# EasyEDA Pro project EasyMatrix工程文件.epro

# Schematic Schematic2_1
Create Date: 2024-02-18; Page Name: P1; Project Name: EasyMatrix像素钟; Schematic Name: Schematic2_1; Update Date: 2024-02-18; Company: 嘉立创EDA; Page Size: A4; Version: V1.0
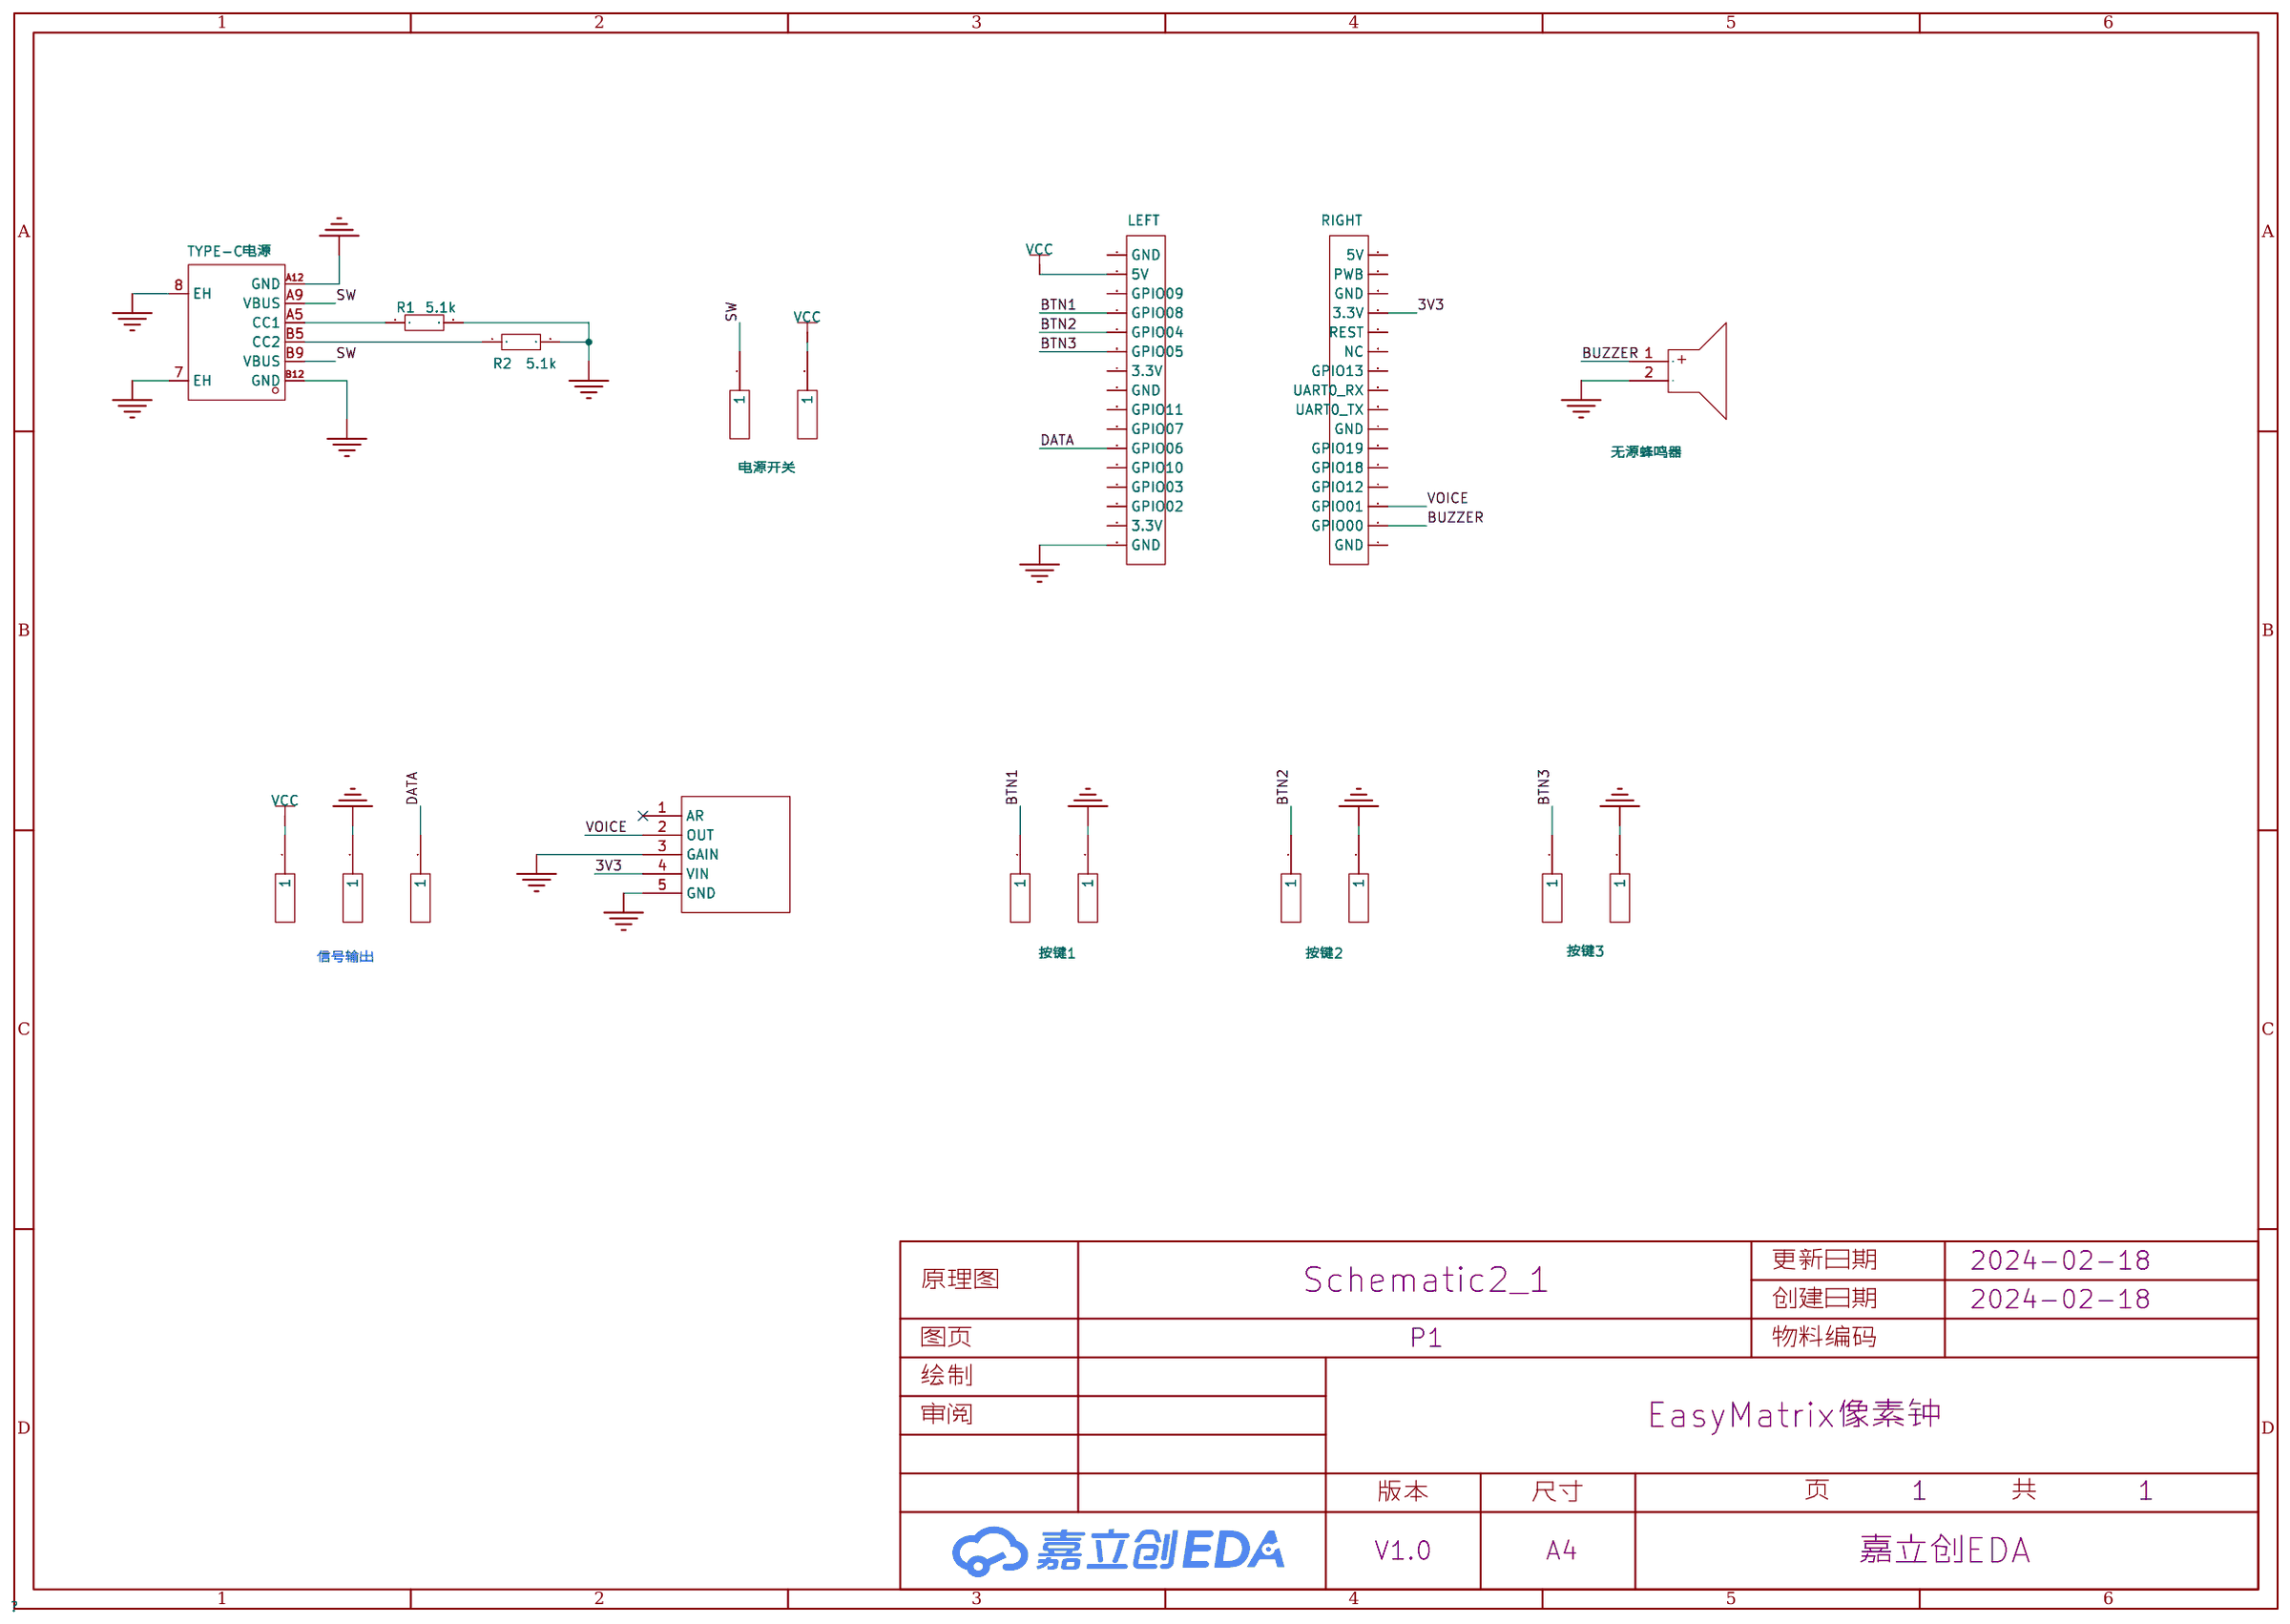
[diagram p0: schematic sheet]

## Parts
LEFT  HDR-F-2.54_1x16  [HDR-F-2.54_1X16]
R1  5.1k  [R0805]
R2  5.1k  [R0805]
RIGHT  HDR-F-2.54_1x16  [HDR-F-2.54_1X16]
TYPE-C电源  TYPE-C 6P LT6.8(073)  [USB-C-SMD_TYPE-C-6P-LT6.8-073]
U1  -  [长圆形单面焊盘]
U4  -  [长圆形单面焊盘]
U6  -  [长圆形单面焊盘]
U8  -  [长圆形单面焊盘]
U10  -  [长圆形单面焊盘]
U13  -  [长圆形单面焊盘]
U14  -  [长圆形单面焊盘]
U15  -  [MAX9814模块]
按键1  -  [长圆形单面焊盘]
按键2  -  [长圆形单面焊盘]
按键3  -  [长圆形单面焊盘]
无源蜂鸣器  无源蜂鸣器  [BUZ-TH_BD12.0-P6.50-D0.6-FD]
电源开关  -  [长圆形单面焊盘]

## Library data of the parts
LEFT RIGHT = HDR-F-2.54_1x16: Supplier Part: C66987; Supplier: LCSC
R1 R2 = Res_0805: Supplier Footprint: 0805
TYPE-C电源 = TYPE-C 6P LT6.8(073): 连接器类型:Type-C;标准:-;公母:母;端口数量:1;触点数量:6P;安装方式:立贴;额定电流 - 电源:3A;工作温度范围:-25℃~+85℃;; LCSC Part Name: Type-C 母 立贴; Supplier Part: C2858271; Manufacturer: SHOU HAN(首韩); Supplier Footprint: SMD; JLCPCB Part Class: 扩展库; Supplier: LCSC; Connector Type: Type-C; Gender: 母; Number of Ports: 1; Number of Contacts: 6P; Mounting Style: 立贴; Current Rating - Power (Max): 3A; Operating Temperature Range: -25℃~+85℃
U1 U4 U6 U8 U10 U13 U14 按键1-按键3 电源开关 = 长圆形单面焊盘
U15 = MAX9814模块: 麦克风放大器; Datasheet: https://github.com/adafruit/Adafruit-MAX9814-AGC-Microphone-PCB
无源蜂鸣器 = YS-MBZ12095C05R42K4000: LCSC Part Name: 蜂鸣器 无源5V42欧4000HZ; Supplier Part: C2891357; Manufacturer: Fengming(锋鸣电子); Supplier Footprint: 插件,P=6.5mm; Datasheet: https://atta.szlcsc.com/upload/public/pdf/source/20210903/1BFBC8824417868F880E44F43CB98B3A.pdf; Supplier: LCSC

## Nets
3V3: RIGHT.13(3.3V) U15.4(VIN)
GND: LEFT.16(GND) R1.2 R2.2 TYPE-C电源.7(EH) TYPE-C电源.8(EH) TYPE-C电源.A12(GND) TYPE-C电源.B12(GND) U1.1 U15.3(GAIN) U15.5(GND) 按键1.1 按键2.1 按键3.1 无源蜂鸣器.2(-)
VCC: LEFT.2(5V) U13.1 电源开关.1
BTN1: LEFT.4(GPIO08) U6.1
BTN2: LEFT.5(GPIO04) U8.1
BTN3: LEFT.6(GPIO05) U10.1
BUZZER: RIGHT.2(GPIO00) 无源蜂鸣器.1(+)
DATA: LEFT.11(GPIO06) U14.1
SW: TYPE-C电源.A9(VBUS) TYPE-C电源.B9(VBUS) U4.1
VOICE: RIGHT.3(GPIO01) U15.2(OUT)
$1N4002: R1.1 TYPE-C电源.A5(CC1)
$1N4005: R2.1 TYPE-C电源.B5(CC2)

Not connected (* = marked no-connect by the designer): LEFT 1(GND) 3(GPIO09) 7(3.3V) 8(GND) 9(GPIO11) 10(GPIO07) 12(GPIO10) 13(GPIO03) 14(GPIO02) 15(3.3V); RIGHT 1(GND) 4(GPIO12) 5(GPIO18) 6(GPIO19) 7(GND) 8(UART0_TX) 9(UART0_RX) 10(GPIO13) 11(NC) 12(REST) 14(GND) 15(PWB) 16(5V); U15 1(AR)*

## Notes on the sheet
- 信号输出

# Schematic Schematic
Create Date: 2024-01-07; Page Name: P1; Project Name: EasyMatrix像素钟; Schematic Name: Schematic; Update Date: 2024-01-12; Company: 嘉立创EDA; Page Size: A4; Version: V1.0
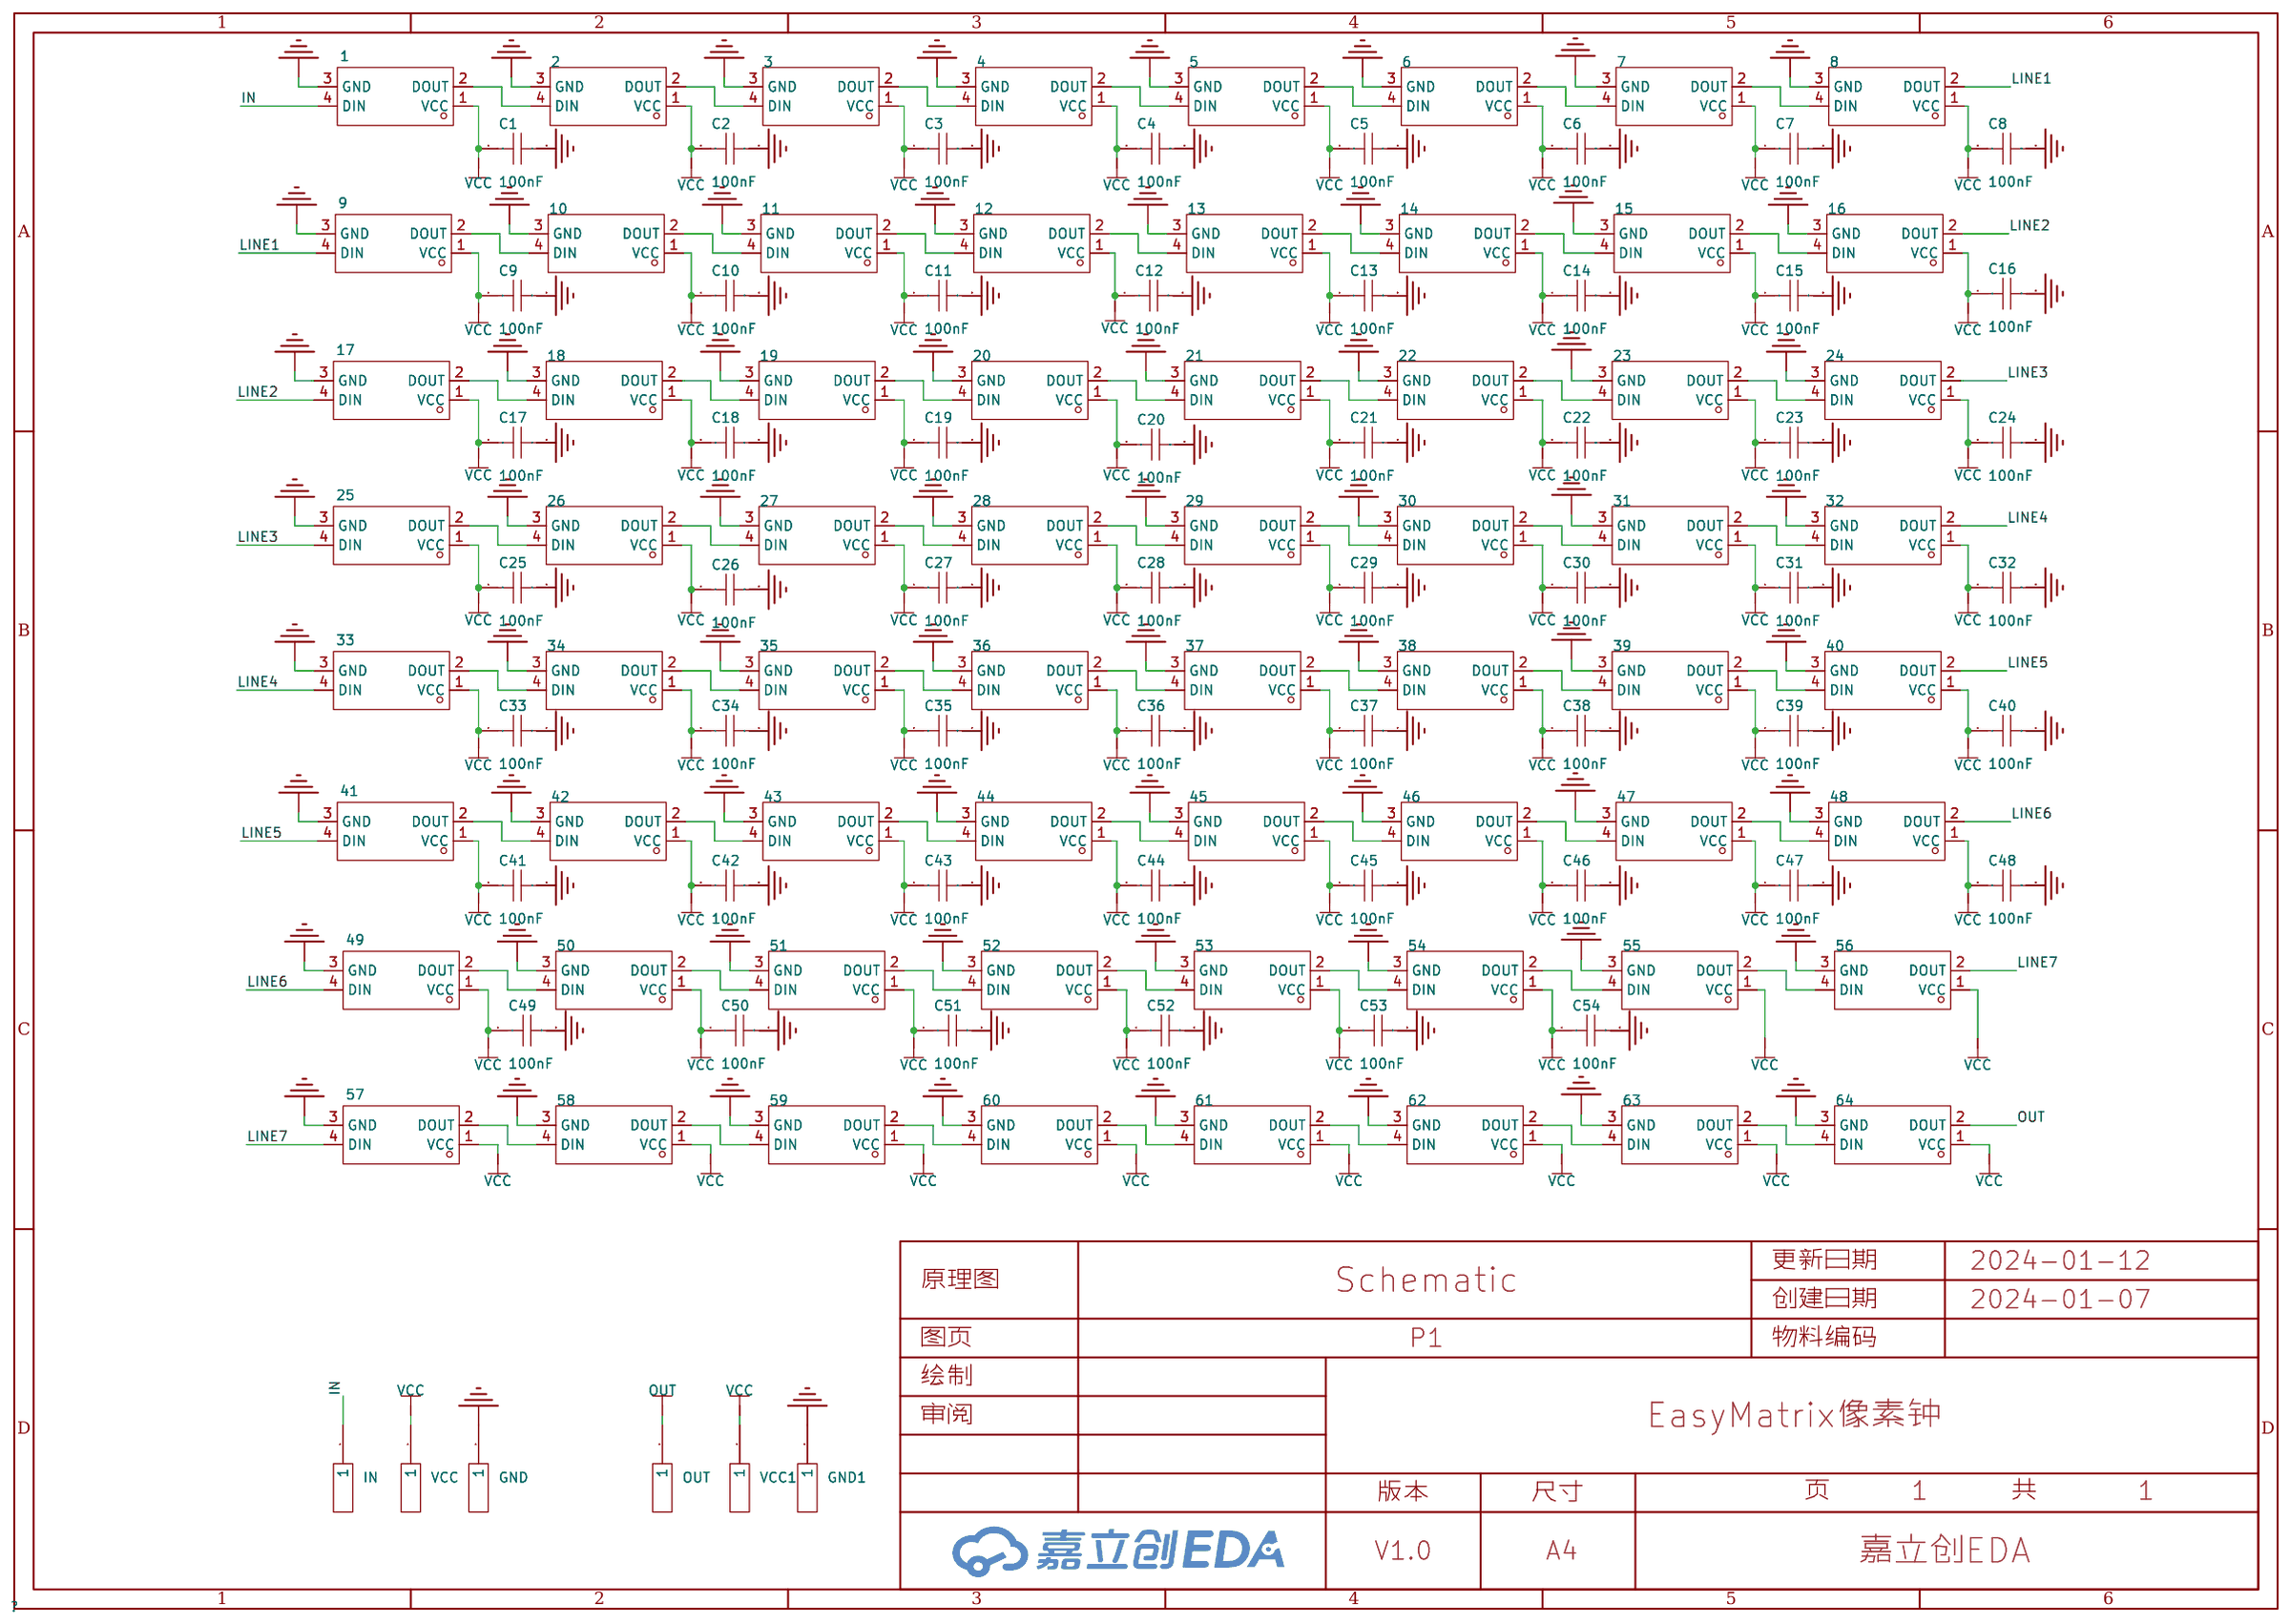
[diagram p1: schematic sheet]

## Parts
1  XL-3528RGBW-WS2812B  [LED-SMD_4P-L3.5-W2.8-BR-1]
2  XL-3528RGBW-WS2812B  [LED-SMD_4P-L3.5-W2.8-BR-1]
3  XL-3528RGBW-WS2812B  [LED-SMD_4P-L3.5-W2.8-BR-1]
4  XL-3528RGBW-WS2812B  [LED-SMD_4P-L3.5-W2.8-BR-1]
5  XL-3528RGBW-WS2812B  [LED-SMD_4P-L3.5-W2.8-BR-1]
6  XL-3528RGBW-WS2812B  [LED-SMD_4P-L3.5-W2.8-BR-1]
7  XL-3528RGBW-WS2812B  [LED-SMD_4P-L3.5-W2.8-BR-1]
8  XL-3528RGBW-WS2812B  [LED-SMD_4P-L3.5-W2.8-BR-1]
9  XL-3528RGBW-WS2812B  [LED-SMD_4P-L3.5-W2.8-BR-1]
10  XL-3528RGBW-WS2812B  [LED-SMD_4P-L3.5-W2.8-BR-1]
11  XL-3528RGBW-WS2812B  [LED-SMD_4P-L3.5-W2.8-BR-1]
12  XL-3528RGBW-WS2812B  [LED-SMD_4P-L3.5-W2.8-BR-1]
13  XL-3528RGBW-WS2812B  [LED-SMD_4P-L3.5-W2.8-BR-1]
14  XL-3528RGBW-WS2812B  [LED-SMD_4P-L3.5-W2.8-BR-1]
15  XL-3528RGBW-WS2812B  [LED-SMD_4P-L3.5-W2.8-BR-1]
16  XL-3528RGBW-WS2812B  [LED-SMD_4P-L3.5-W2.8-BR-1]
17  XL-3528RGBW-WS2812B  [LED-SMD_4P-L3.5-W2.8-BR-1]
18  XL-3528RGBW-WS2812B  [LED-SMD_4P-L3.5-W2.8-BR-1]
19  XL-3528RGBW-WS2812B  [LED-SMD_4P-L3.5-W2.8-BR-1]
20  XL-3528RGBW-WS2812B  [LED-SMD_4P-L3.5-W2.8-BR-1]
21  XL-3528RGBW-WS2812B  [LED-SMD_4P-L3.5-W2.8-BR-1]
22  XL-3528RGBW-WS2812B  [LED-SMD_4P-L3.5-W2.8-BR-1]
23  XL-3528RGBW-WS2812B  [LED-SMD_4P-L3.5-W2.8-BR-1]
24  XL-3528RGBW-WS2812B  [LED-SMD_4P-L3.5-W2.8-BR-1]
25  XL-3528RGBW-WS2812B  [LED-SMD_4P-L3.5-W2.8-BR-1]
26  XL-3528RGBW-WS2812B  [LED-SMD_4P-L3.5-W2.8-BR-1]
27  XL-3528RGBW-WS2812B  [LED-SMD_4P-L3.5-W2.8-BR-1]
28  XL-3528RGBW-WS2812B  [LED-SMD_4P-L3.5-W2.8-BR-1]
29  XL-3528RGBW-WS2812B  [LED-SMD_4P-L3.5-W2.8-BR-1]
30  XL-3528RGBW-WS2812B  [LED-SMD_4P-L3.5-W2.8-BR-1]
31  XL-3528RGBW-WS2812B  [LED-SMD_4P-L3.5-W2.8-BR-1]
32  XL-3528RGBW-WS2812B  [LED-SMD_4P-L3.5-W2.8-BR-1]
33  XL-3528RGBW-WS2812B  [LED-SMD_4P-L3.5-W2.8-BR-1]
34  XL-3528RGBW-WS2812B  [LED-SMD_4P-L3.5-W2.8-BR-1]
35  XL-3528RGBW-WS2812B  [LED-SMD_4P-L3.5-W2.8-BR-1]
36  XL-3528RGBW-WS2812B  [LED-SMD_4P-L3.5-W2.8-BR-1]
37  XL-3528RGBW-WS2812B  [LED-SMD_4P-L3.5-W2.8-BR-1]
38  XL-3528RGBW-WS2812B  [LED-SMD_4P-L3.5-W2.8-BR-1]
39  XL-3528RGBW-WS2812B  [LED-SMD_4P-L3.5-W2.8-BR-1]
40  XL-3528RGBW-WS2812B  [LED-SMD_4P-L3.5-W2.8-BR-1]
41  XL-3528RGBW-WS2812B  [LED-SMD_4P-L3.5-W2.8-BR-1]
42  XL-3528RGBW-WS2812B  [LED-SMD_4P-L3.5-W2.8-BR-1]
43  XL-3528RGBW-WS2812B  [LED-SMD_4P-L3.5-W2.8-BR-1]
44  XL-3528RGBW-WS2812B  [LED-SMD_4P-L3.5-W2.8-BR-1]
45  XL-3528RGBW-WS2812B  [LED-SMD_4P-L3.5-W2.8-BR-1]
46  XL-3528RGBW-WS2812B  [LED-SMD_4P-L3.5-W2.8-BR-1]
47  XL-3528RGBW-WS2812B  [LED-SMD_4P-L3.5-W2.8-BR-1]
48  XL-3528RGBW-WS2812B  [LED-SMD_4P-L3.5-W2.8-BR-1]
49  XL-3528RGBW-WS2812B  [LED-SMD_4P-L3.5-W2.8-BR-1]
50  XL-3528RGBW-WS2812B  [LED-SMD_4P-L3.5-W2.8-BR-1]
51  XL-3528RGBW-WS2812B  [LED-SMD_4P-L3.5-W2.8-BR-1]
52  XL-3528RGBW-WS2812B  [LED-SMD_4P-L3.5-W2.8-BR-1]
53  XL-3528RGBW-WS2812B  [LED-SMD_4P-L3.5-W2.8-BR-1]
54  XL-3528RGBW-WS2812B  [LED-SMD_4P-L3.5-W2.8-BR-1]
55  XL-3528RGBW-WS2812B  [LED-SMD_4P-L3.5-W2.8-BR-1]
56  XL-3528RGBW-WS2812B  [LED-SMD_4P-L3.5-W2.8-BR-1]
57  XL-3528RGBW-WS2812B  [LED-SMD_4P-L3.5-W2.8-BR-1]
58  XL-3528RGBW-WS2812B  [LED-SMD_4P-L3.5-W2.8-BR-1]
59  XL-3528RGBW-WS2812B  [LED-SMD_4P-L3.5-W2.8-BR-1]
60  XL-3528RGBW-WS2812B  [LED-SMD_4P-L3.5-W2.8-BR-1]
61  XL-3528RGBW-WS2812B  [LED-SMD_4P-L3.5-W2.8-BR-1]
62  XL-3528RGBW-WS2812B  [LED-SMD_4P-L3.5-W2.8-BR-1]
63  XL-3528RGBW-WS2812B  [LED-SMD_4P-L3.5-W2.8-BR-1]
64  XL-3528RGBW-WS2812B  [LED-SMD_4P-L3.5-W2.8-BR-1]
C1  100nF  [C0805]
C2  100nF  [C0805]
C3  100nF  [C0805]
C4  100nF  [C0805]
C5  100nF  [C0805]
C6  100nF  [C0805]
C7  100nF  [C0805]
C8  100nF  [C0805]
C9  100nF  [C0805]
C10  100nF  [C0805]
C11  100nF  [C0805]
C12  100nF  [C0805]
C13  100nF  [C0805]
C14  100nF  [C0805]
C15  100nF  [C0805]
C16  100nF  [C0805]
C17  100nF  [C0805]
C18  100nF  [C0805]
C19  100nF  [C0805]
C20  100nF  [C0805]
C21  100nF  [C0805]
C22  100nF  [C0805]
C23  100nF  [C0805]
C24  100nF  [C0805]
C25  100nF  [C0805]
C26  100nF  [C0805]
C27  100nF  [C0805]
C28  100nF  [C0805]
C29  100nF  [C0805]
C30  100nF  [C0805]
C31  100nF  [C0805]
C32  100nF  [C0805]
C33  100nF  [C0805]
C34  100nF  [C0805]
C35  100nF  [C0805]
C36  100nF  [C0805]
C37  100nF  [C0805]
C38  100nF  [C0805]
C39  100nF  [C0805]
C40  100nF  [C0805]
C41  100nF  [C0805]
C42  100nF  [C0805]
C43  100nF  [C0805]
C44  100nF  [C0805]
C45  100nF  [C0805]
C46  100nF  [C0805]
C47  100nF  [C0805]
C48  100nF  [C0805]
C49  100nF  [C0805]
C50  100nF  [C0805]
C51  100nF  [C0805]
C52  100nF  [C0805]
C53  100nF  [C0805]
C54  100nF  [C0805]
GND  -  [长圆形单面焊盘]
GND1  -  [长圆形单面焊盘]
IN  -  [长圆形单面焊盘]
OUT  -  [长圆形单面焊盘]
VCC  -  [长圆形单面焊盘]
VCC1  -  [长圆形单面焊盘]

## Library data of the parts
1-64 = XL-3528RGBW-WS2812B: 发光颜色:RGB三色;二极管配置:共阳极;主波长:618nm~623nm；520nm~525nm；467nm~472nm;峰值波长:525nm；623nm；472nm;光通量(25℃时):-;测试电流:20mA;正向电压(VF):3.4V；3.4V；2.4V;发光强度:143mcd；240mcd；845mcd;功率:50mW；50mW；45mW;发光角度:120°;安装方式:正贴;工作温度:-25℃~+80℃;; LCSC Part Name: RGB三色 共阳极 正贴 幻彩; Supplier Part: C2890364; Manufacturer: XINGLIGHT(成兴光); Supplier Footprint: SMD,3.5x2.8x1.85mm; JLCPCB Part Class: 扩展库; Datasheet: https://atta.szlcsc.com/upload/public/pdf/source/20210827/1CA9F253977F45DC01BA0C3D415B306E.pdf; Supplier: LCSC; Emitted Color: RGB三色; Diode Configuration: 共阳极; Dominant Wavelength: 618nm~623nm；520nm~525nm；467nm~472nm; Peak Wavelength: 525nm；623nm；472nm; Forward Current: 20mA; Forward Voltage (VF): 3.4V；3.4V；2.4V; Luminous Intensity: 143mcd；240mcd；845mcd; Power Dissipation: 50mW；50mW；45mW; Viewing Angle: 120°; Mounting Sytle: 正贴; Operating Temperature: -25℃~+80℃
C1-C54 = CAP_0805: Supplier Footprint: 0805
GND GND1 IN OUT VCC VCC1 = 长圆形单面焊盘

## Nets
GND: 1.3(GND) 2.3(GND) 3.3(GND) 4.3(GND) 5.3(GND) 6.3(GND) 7.3(GND) 8.3(GND) 9.3(GND) 10.3(GND) 11.3(GND) 12.3(GND) 13.3(GND) 14.3(GND) 15.3(GND) 16.3(GND) 17.3(GND) 18.3(GND) 19.3(GND) 20.3(GND) 21.3(GND) 22.3(GND) 23.3(GND) 24.3(GND) 25.3(GND) 26.3(GND) 27.3(GND) 28.3(GND) 29.3(GND) 30.3(GND) 31.3(GND) 32.3(GND) 33.3(GND) 34.3(GND) 35.3(GND) 36.3(GND) 37.3(GND) 38.3(GND) 39.3(GND) 40.3(GND) 41.3(GND) 42.3(GND) 43.3(GND) 44.3(GND) 45.3(GND) 46.3(GND) 47.3(GND) 48.3(GND) 49.3(GND) 50.3(GND) 51.3(GND) 52.3(GND) 53.3(GND) 54.3(GND) 55.3(GND) 56.3(GND) 57.3(GND) 58.3(GND) 59.3(GND) 60.3(GND) 61.3(GND) 62.3(GND) 63.3(GND) 64.3(GND) C1.2 C2.2 C3.2 C4.2 C5.2 C6.2 C7.2 C8.2 C9.2 C10.2 C11.2 C12.2 C13.2 C14.2 C15.2 C16.2 C17.2 C18.2 C19.2 C20.2 C21.2 C22.2 C23.2 C24.2 C25.2 C26.2 C27.2 C28.2 C29.2 C30.2 C31.2 C32.2 C33.2 C34.2 C35.2 C36.2 C37.2 C38.2 C39.2 C40.2 C41.2 C42.2 C43.2 C44.2 C45.2 C46.2 C47.2 C48.2 C49.2 C50.2 C51.2 C52.2 C53.2 C54.2 GND.1 GND1.1
VCC: 1.1(VCC) 2.1(VCC) 3.1(VCC) 4.1(VCC) 5.1(VCC) 6.1(VCC) 7.1(VCC) 8.1(VCC) 9.1(VCC) 10.1(VCC) 11.1(VCC) 12.1(VCC) 13.1(VCC) 14.1(VCC) 15.1(VCC) 16.1(VCC) 17.1(VCC) 18.1(VCC) 19.1(VCC) 20.1(VCC) 21.1(VCC) 22.1(VCC) 23.1(VCC) 24.1(VCC) 25.1(VCC) 26.1(VCC) 27.1(VCC) 28.1(VCC) 29.1(VCC) 30.1(VCC) 31.1(VCC) 32.1(VCC) 33.1(VCC) 34.1(VCC) 35.1(VCC) 36.1(VCC) 37.1(VCC) 38.1(VCC) 39.1(VCC) 40.1(VCC) 41.1(VCC) 42.1(VCC) 43.1(VCC) 44.1(VCC) 45.1(VCC) 46.1(VCC) 47.1(VCC) 48.1(VCC) 49.1(VCC) 50.1(VCC) 51.1(VCC) 52.1(VCC) 53.1(VCC) 54.1(VCC) 55.1(VCC) 56.1(VCC) 57.1(VCC) 58.1(VCC) 59.1(VCC) 60.1(VCC) 61.1(VCC) 62.1(VCC) 63.1(VCC) 64.1(VCC) C1.1 C2.1 C3.1 C4.1 C5.1 C6.1 C7.1 C8.1 C9.1 C10.1 C11.1 C12.1 C13.1 C14.1 C15.1 C16.1 C17.1 C18.1 C19.1 C20.1 C21.1 C22.1 C23.1 C24.1 C25.1 C26.1 C27.1 C28.1 C29.1 C30.1 C31.1 C32.1 C33.1 C34.1 C35.1 C36.1 C37.1 C38.1 C39.1 C40.1 C41.1 C42.1 C43.1 C44.1 C45.1 C46.1 C47.1 C48.1 C49.1 C50.1 C51.1 C52.1 C53.1 C54.1 VCC.1 VCC1.1
IN: 1.4(DIN) IN.1
LINE1: 8.2(DOUT) 9.4(DIN)
LINE2: 16.2(DOUT) 17.4(DIN)
LINE3: 24.2(DOUT) 25.4(DIN)
LINE4: 32.2(DOUT) 33.4(DIN)
LINE5: 40.2(DOUT) 41.4(DIN)
LINE6: 48.2(DOUT) 49.4(DIN)
LINE7: 56.2(DOUT) 57.4(DIN)
OUT: 64.2(DOUT) OUT.1
$1N1182: 1.2(DOUT) 2.4(DIN)
$1N1185: 2.2(DOUT) 3.4(DIN)
$1N1190: 4.2(DOUT) 5.4(DIN)
$1N1193: 5.2(DOUT) 6.4(DIN)
$1N1194: 3.2(DOUT) 4.4(DIN)
$1N1199: 7.2(DOUT) 8.4(DIN)
$1N1203: 6.2(DOUT) 7.4(DIN)
$1N7369: 9.2(DOUT) 10.4(DIN)
$1N7372: 10.2(DOUT) 11.4(DIN)
$1N7377: 12.2(DOUT) 13.4(DIN)
$1N7380: 13.2(DOUT) 14.4(DIN)
$1N7381: 11.2(DOUT) 12.4(DIN)
$1N7386: 15.2(DOUT) 16.4(DIN)
$1N7387: 14.2(DOUT) 15.4(DIN)
$1N7912: 17.2(DOUT) 18.4(DIN)
$1N7915: 18.2(DOUT) 19.4(DIN)
$1N7920: 20.2(DOUT) 21.4(DIN)
$1N7923: 21.2(DOUT) 22.4(DIN)
$1N7924: 19.2(DOUT) 20.4(DIN)
$1N7929: 23.2(DOUT) 24.4(DIN)
$1N7930: 22.2(DOUT) 23.4(DIN)
$1N8455: 25.2(DOUT) 26.4(DIN)
$1N8458: 26.2(DOUT) 27.4(DIN)
$1N8463: 28.2(DOUT) 29.4(DIN)
$1N8466: 29.2(DOUT) 30.4(DIN)
$1N8467: 27.2(DOUT) 28.4(DIN)
$1N8472: 31.2(DOUT) 32.4(DIN)
$1N8473: 30.2(DOUT) 31.4(DIN)
$1N8998: 33.2(DOUT) 34.4(DIN)
$1N9001: 34.2(DOUT) 35.4(DIN)
$1N9006: 36.2(DOUT) 37.4(DIN)
$1N9009: 37.2(DOUT) 38.4(DIN)
$1N9010: 35.2(DOUT) 36.4(DIN)
$1N9015: 39.2(DOUT) 40.4(DIN)
$1N9016: 38.2(DOUT) 39.4(DIN)
$1N9541: 41.2(DOUT) 42.4(DIN)
$1N9544: 42.2(DOUT) 43.4(DIN)
$1N9549: 44.2(DOUT) 45.4(DIN)
$1N9552: 45.2(DOUT) 46.4(DIN)
$1N9553: 43.2(DOUT) 44.4(DIN)
$1N9558: 47.2(DOUT) 48.4(DIN)
$1N9559: 46.2(DOUT) 47.4(DIN)
$1N10084: 49.2(DOUT) 50.4(DIN)
$1N10087: 50.2(DOUT) 51.4(DIN)
$1N10092: 52.2(DOUT) 53.4(DIN)
$1N10095: 53.2(DOUT) 54.4(DIN)
$1N10096: 51.2(DOUT) 52.4(DIN)
$1N10101: 55.2(DOUT) 56.4(DIN)
$1N10102: 54.2(DOUT) 55.4(DIN)
$1N10627: 57.2(DOUT) 58.4(DIN)
$1N10630: 58.2(DOUT) 59.4(DIN)
$1N10635: 60.2(DOUT) 61.4(DIN)
$1N10638: 61.2(DOUT) 62.4(DIN)
$1N10639: 59.2(DOUT) 60.4(DIN)
$1N10644: 63.2(DOUT) 64.4(DIN)
$1N10645: 62.2(DOUT) 63.4(DIN)

# Board PCB3_1
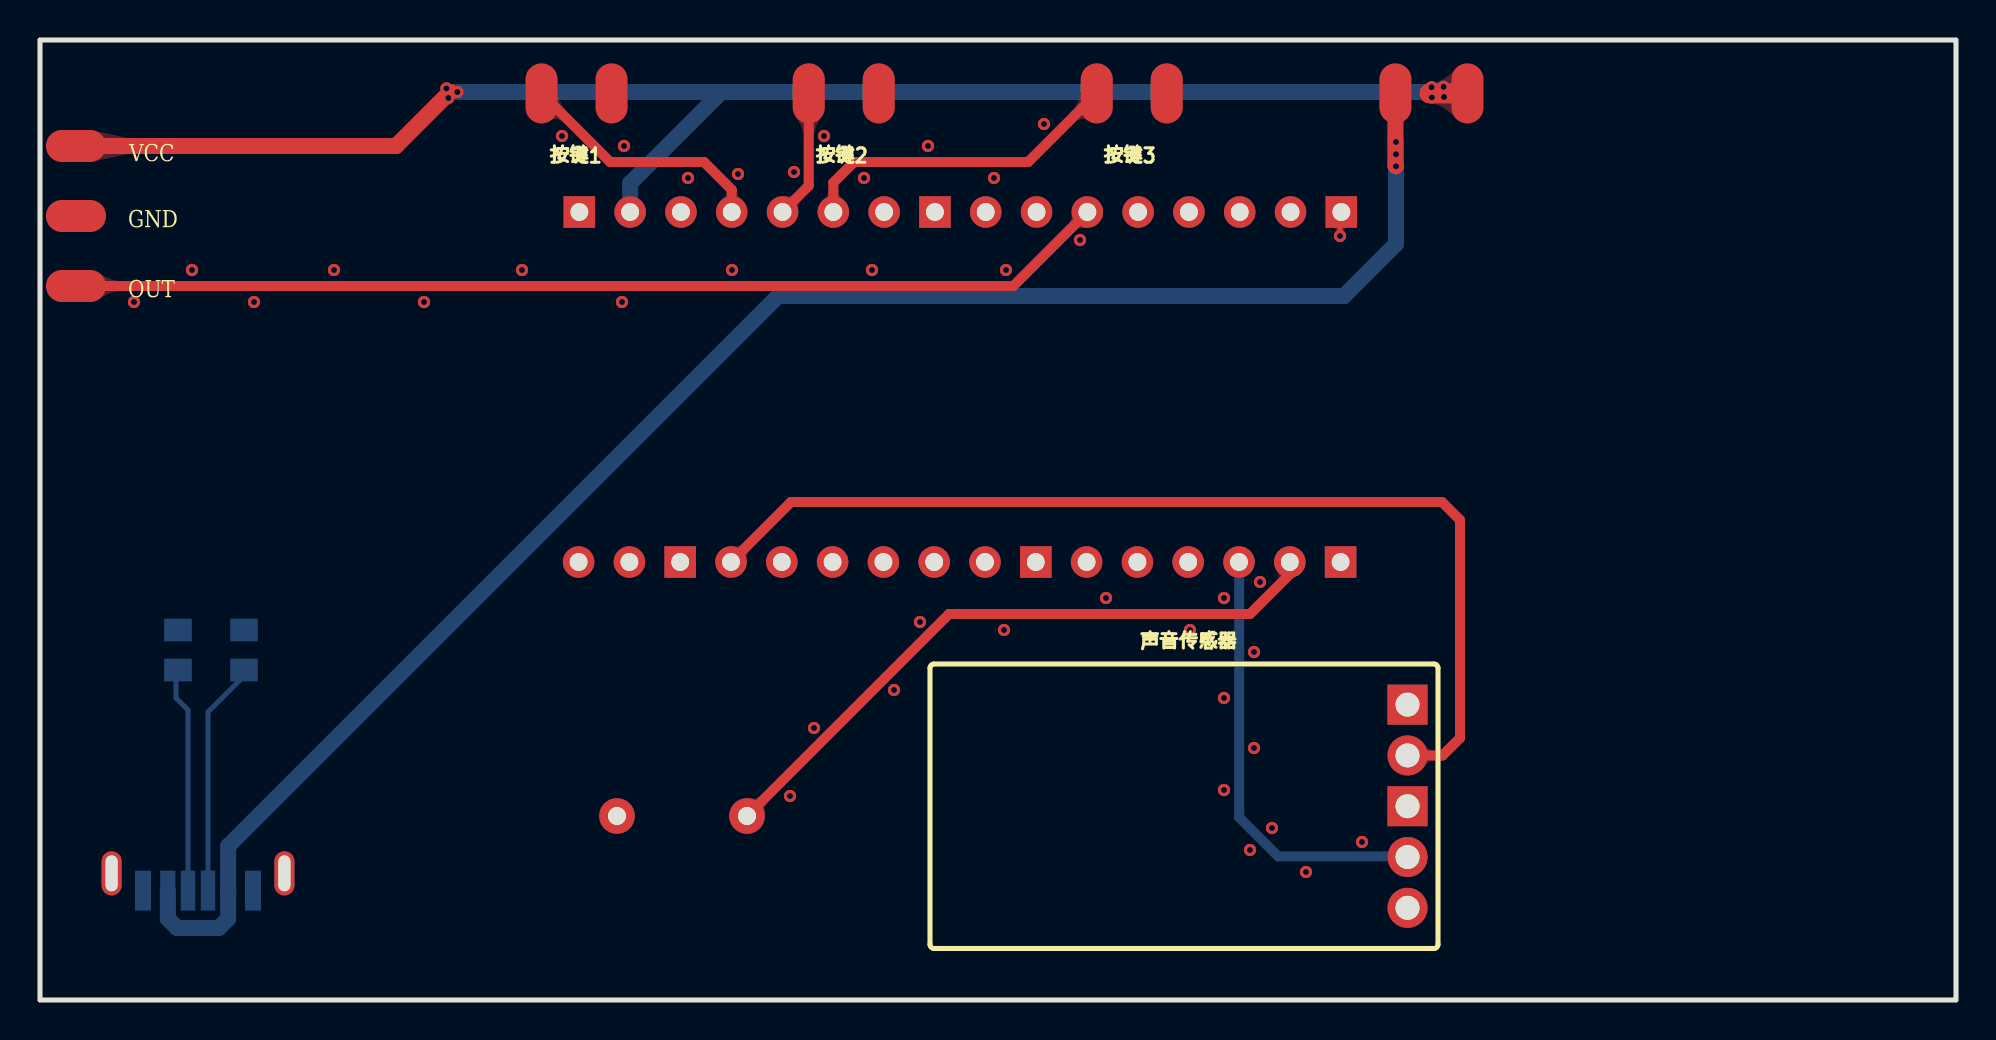
[diagram p2: board, top side]
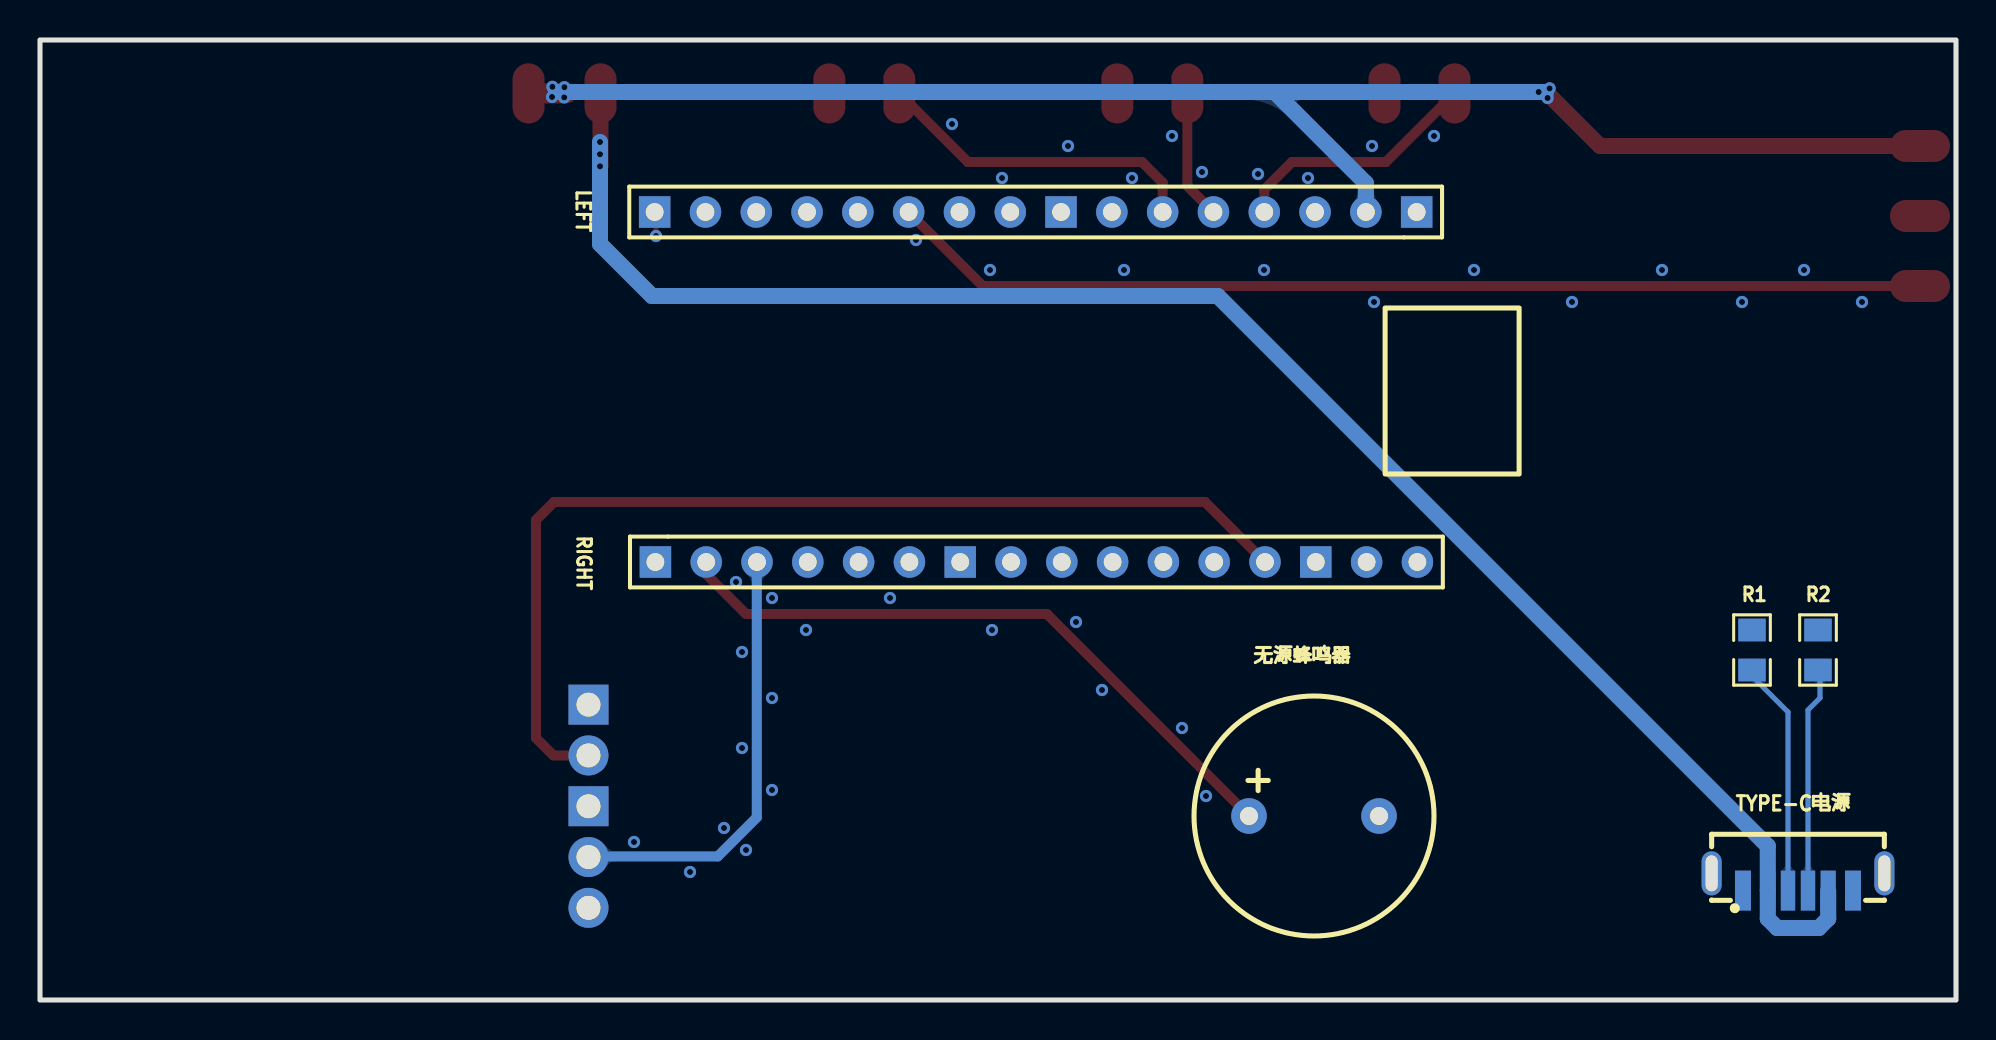
[diagram p3: board, bottom side, seen from below]

Outline 95.8 x 48 mm; copper layers: Top Layer, Bottom Layer. Coordinates in mm from the lower left corner of the outline.
Outline path: rectangle 0,48 95.8,0
Stack: Top Layer 0.035mm - / Dielectric1 1.51mm FR4 er 4.5 / Bottom Layer 0.035mm -

## Design rules (mm)
template: JLCPCB Capability(Two Layers Board)
spacing copperThickness1oz (default): track to track 0.102, other pairs 0.152 to 0.3
spacing copperThickness2oz: track to track 0.203, other pairs 0.152 to 0.3
track width copperThickness1oz (default): min 0.127, default 0.254, max 2.54
track width copperThickness2oz: min 0.203, default 0.254, max 2.54
differential pair differentialPair (default): width min 0.127, default 0.254, max 2.54; gap min 0.152, default 0.152
via viaSize (default): diameter min 0.5, default 0.61, max 10; hole min 0.3, default 0.305, max 6.3

## Placement (name value [footprint] x y rotation side)
LEFT  HDR-F-2.54_1x16  [hdr-f-2.54_1x16]  46.02 39.4 0 bottom
NOREF  -  [长圆形单面焊盘]  1.8 39.33 0 top
R1  5.1k  [R0805]  10.2 17.5 90 bottom
R2  5.1k  [R0805]  6.9 17.5 90 bottom
RIGHT  HDR-F-2.54_1x16  [HDR-F-2.54_1X16]  45.98 21.9 180 bottom
TYPE-C电源  TYPE-C 6P LT6.8(073)  [USB-C-SMD_TYPE-C-6P-LT6.8-073]  7.9 5.9 180 bottom
U4  -  [长圆形单面焊盘]  67.9 45.33 270 top
U6  -  [长圆形单面焊盘]  24.95 45.33 90 top
U8  -  [长圆形单面焊盘]  38.31 45.33 90 top
U10  -  [长圆形单面焊盘]  52.71 45.33 90 top
U13  -  [长圆形单面焊盘]  1.8 42.83 0 top
U14  -  [长圆形单面焊盘]  1.8 35.83 0 top
声音传感器  -  [max9814模块]  44.5 16.8 0 top
按键1  -  [长圆形单面焊盘]  28.45 45.33 90 top
按键2  -  [长圆形单面焊盘]  41.81 45.33 90 top
按键3  -  [长圆形单面焊盘]  56.21 45.33 90 top
无源蜂鸣器  无源蜂鸣器  [BUZ-TH_BD12.0-P6.50-D0.6-FD]  32.1 9.2 180 bottom
电源开关  -  [长圆形单面焊盘]  71.5 45.33 270 top

## Footprints (pads in the part's own frame, mm; a bottom-side part is the same pattern mirrored in y, then rotated)
BUZ-TH_BD12.0-P6.50-D0.6-FD
  round 1.778 hole 0.899: 1(-3.251,0) 2(3.251,0)
HDR-F-2.54_1X16
  rect 1.575x1.575 hole 0.889: 1(-19.05,0) 7(-3.81,0) 14(13.97,0)
  round 1.575 hole 0.889: 2(-16.51,0) 3(-13.97,0) 4(-11.43,0) 5(-8.89,0) 6(-6.35,0) 8(-1.27,0) 9(1.27,0) 10(3.81,0) 11(6.35,0) 12(8.89,0) 13(11.43,0) 15(16.51,0) 16(19.05,0)
hdr-f-2.54_1x16
  rect 1.575x1.575 hole 0.889: 1(-19.05,0) 8(-1.27,0) 16(19.05,0)
  round 1.575 hole 0.889: 2(-16.51,0) 3(-13.97,0) 4(-11.43,0) 5(-8.89,0) 6(-6.35,0) 7(-3.81,0) 9(1.27,0) 10(3.81,0) 11(6.35,0) 12(8.89,0) 13(11.43,0) 14(13.97,0) 15(16.51,0)
max9814模块
  round 2 hole 1.2: 1(23.876,-12.192) 2(23.876,-9.652) 4(23.876,-4.572)
  rect 2x2 hole 1.2: 3(23.876,-7.112) 5(23.876,-2.032)
R0805
  rect 1.133x1.377 smd: 1(-1,0) 2(1,0)
USB-C-SMD_TYPE-C-6P-LT6.8-073
  oval 1x2.2 hole 0.6x1.8: 7(-4.32,0.432) 8(4.32,0.432)
  rect 0.72x2 smd: A5(-0.5,-0.432) B5(0.5,-0.432)
  rect 0.76x2 smd: A9(1.51,-0.432) B9(-1.51,-0.432)
  custom 0.8x2 smd: A12(2.75,-0.432)
  rect 0.8x2 smd: B12(-2.75,-0.432)
长圆形单面焊盘
  oval 3x1.6 smd: 1(0,-0.127)

## Nets
3V3: RIGHT.13 声音传感器.4
GND: LEFT.16 NOREF.1 R1.2 R2.2 TYPE-C电源.7 TYPE-C电源.8 TYPE-C电源.A12 TYPE-C电源.B12 声音传感器.3 声音传感器.5 按键1.1 按键2.1 按键3.1 无源蜂鸣器.2
VCC: LEFT.2 U13.1 电源开关.1
BTN1: LEFT.4 U6.1
BTN2: LEFT.5 U8.1
BTN3: LEFT.6 U10.1
BUZZER: RIGHT.2 无源蜂鸣器.1
DATA: LEFT.11 U14.1
SW: TYPE-C电源.A9 TYPE-C电源.B9 U4.1
VOICE: RIGHT.3 声音传感器.2
$1N4002: R1.1 TYPE-C电源.A5
$1N4005: R2.1 TYPE-C电源.B5

Pads without a net: LEFT 1 3 7 8 9 10 12 13 14 15; RIGHT 1 4 5 6 7 8 9 10 11 12 14 15 16; 声音传感器 1

## Via types
v1: diameter 0.61, hole 0.305, Top Layer to Bottom Layer, 49 vias

## Routing (per net, layer and track width the routed paths; a pad name or vN(x,y) marks a point on that pad's centre or on a via; arc(x,y) is an arc through that point)
3V3: length 52
  Top Layer w0.5: 声音传感器.4 70.13,12.23 71,13.1 71,24 70.1,24.9 37.55,24.9 RIGHT.13
GND: length 1.2
  Top Layer w0.254: 64.99,39.4 65,39.39 v1(65,38.2)
  vias: v1(4.7,34.9) v1(7.6,36.5) v1(10.7,34.9) v1(14.7,36.5) v1(19.2,34.9) v1(24.1,36.5) v1(26.1,43.2) v1(29.1,34.9) v1(29.2,42.7) v1(32.4,41.1) v1(34.6,36.5) v1(34.9,41.3) v1(37.5,10.2) v1(37.7,41.4) v1(38.7,13.6) v1(39.2,43.2) v1(41.2,41.1) v1(41.6,36.5) v1(42.7,15.5) v1(44,18.9) v1(44.4,42.7) v1(47.7,41.1) v1(48.2,18.5) v1(48.3,36.5) v1(50.2,43.8) v1(52,38) v1(53.3,20.1) v1(57.5,18.5) v1(59.2,20.1) v1(59.2,15.1) v1(59.2,10.5) v1(60.5,7.5) v1(60.7,17.4) v1(60.7,12.6) v1(61,20.9) v1(61.6,8.6) v1(63.3,6.4) v1(66.1,7.9)
VCC: length 79.1
  Top Layer w0.254: 29.45,39.38 29.43,39.4
  Top Layer w0.8: 20.5,45.4 17.8,42.7 U13.1
  Top Layer w1: 69.48,45.33 电源开关.1
  Bottom Layer w0.8: 34.07,45.4 70,45.4 ; 34.07,45.4 29.51,40.84 LEFT.2 ; 34.07,45.4 v1(20.87,45.4) 20.5,45.4
  vias: v1(20.32,45.58) v1(20.42,45.1) v1(69.58,45.64) v1(69.59,45.13) v1(70.18,45.66) v1(70.2,45.15)
BTN1: length 12.6
  Top Layer w0.5: U6.1 28.51,41.9 33.2,41.9 34.59,40.51 LEFT.4
BTN2: length 6.5
  Top Layer w0.5: U8.1 38.44,40.71 LEFT.5
BTN3: length 16.5
  Top Layer w0.5: LEFT.6 39.67,40.87 40.7,41.9 49.41,41.9 52.84,45.33
BUZZER: length 32.8
  Top Layer w0.5: 无源蜂鸣器.1 45.45,19.3 60.5,19.3 62.49,21.29 RIGHT.2
DATA: length 52.1
  Top Layer w0.5: LEFT.11 48.67,35.7 U14.1
SW: length 88.1
  Top Layer w0.8: v1(67.8,41.69) 67.77,41.71 U4.1
  Bottom Layer w0.8: TYPE-C电源.A9 6.39,4.07 6.86,3.6 8.94,3.6 9.41,4.07 TYPE-C电源.B9 9.41,7.7 36.91,35.2 65.2,35.2 67.8,37.8 v1(67.8,41.69) v1(67.8,42.29) v1(67.8,42.9)
VOICE: length 22
  Bottom Layer w0.5: 声音传感器.2 68.34,7.18 61.91,7.18 59.96,9.13 59.96,21.89 RIGHT.3
$1N4002: length 11.8
  Bottom Layer w0.254: TYPE-C电源.A5 8.4,14.4 10.2,16.2 R1.1
$1N4005: length 11.3
  Bottom Layer w0.254: TYPE-C电源.B5 7.4,14.5 6.8,15.1 6.8,16.4 R2.1

## Copper pours and planes (outline as drawn; the poured copper is in the pictures)
GND on Top Layer: -2.1,51 99.3,51 99.3,-4.1 -2.1,-4.1
GND on Bottom Layer: -3,52.7 99.7,52.7 99.7,-5.7 -3,-5.7

Small or netless copper shapes (teardrops, artwork), in the pictures only: 17 on Top Layer, 8 on Bottom Layer

## Text on the board
Top Silkscreen Layer: GND | OUT | VCC

# Board PCB
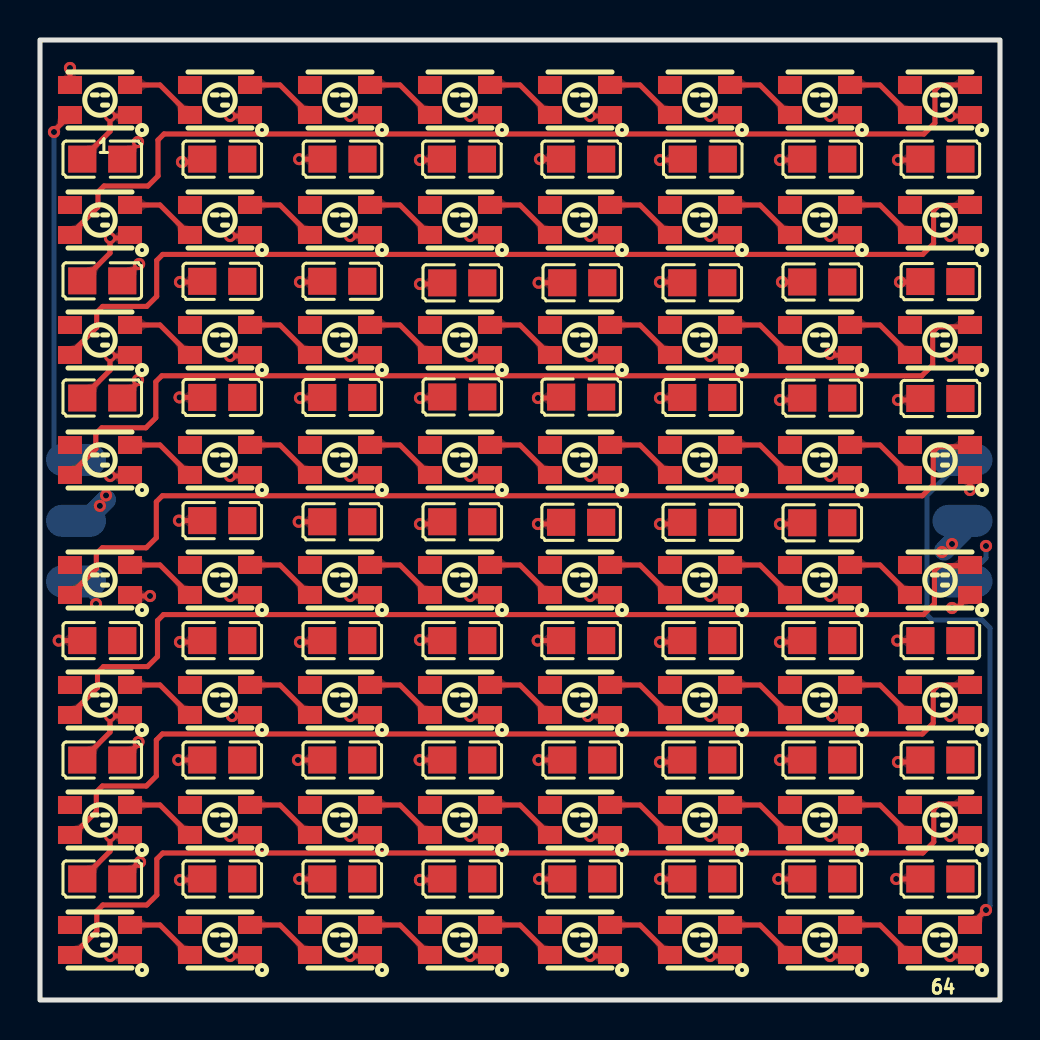
[diagram p4: board, top side]
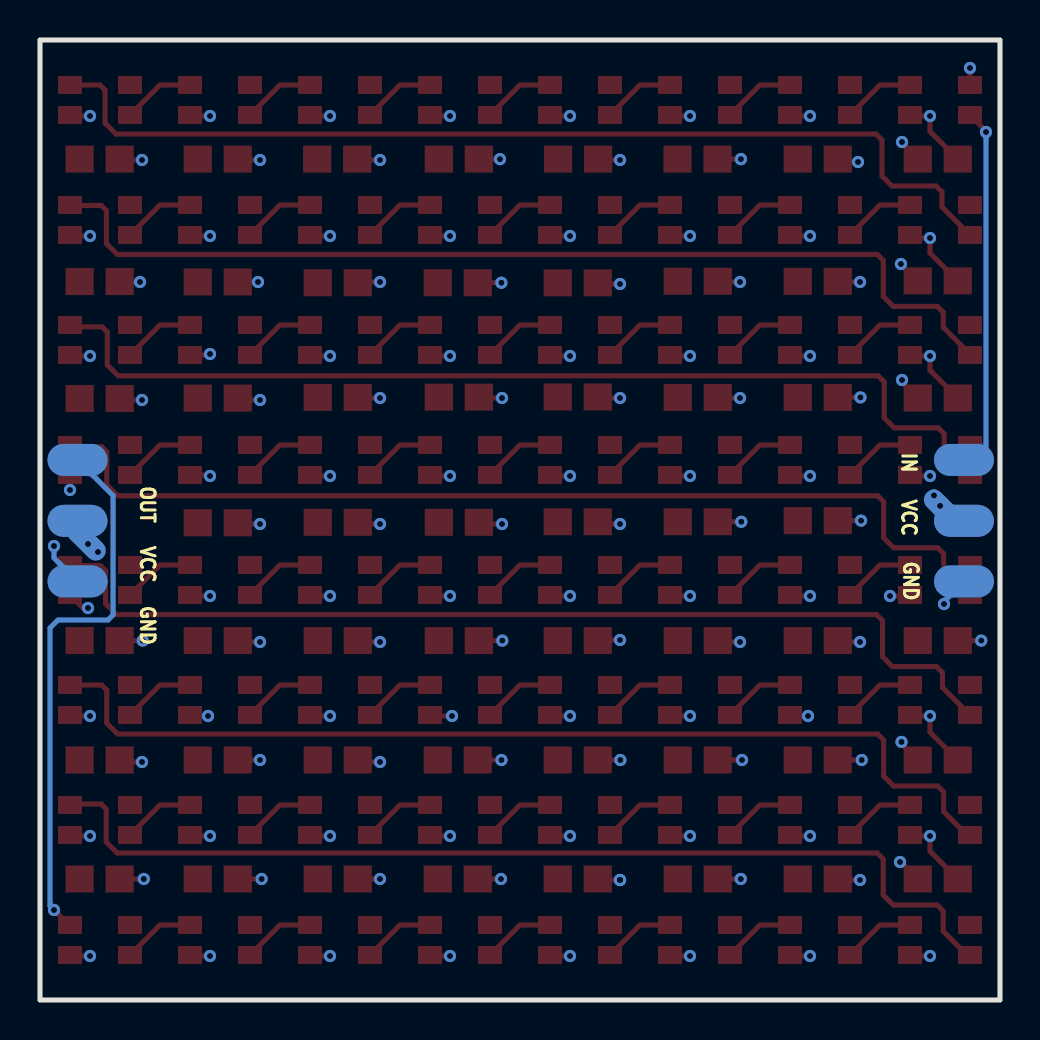
[diagram p5: board, bottom side, seen from below]

Outline 48 x 48 mm; copper layers: Top Layer, VCC, GND, Bottom Layer. Coordinates in mm from the lower left corner of the outline.
Outline path: rectangle 0,48 48,0
Stack: Top Layer 0.035mm 外层铜厚1oz / Dielectric1 0.2104mm 7628 RC49% 8.6mil / VCC 0.0152mm 内层铜厚 / Dielectric2 1.065mm 1.1mm H/HOZ 含铜 / GND 0.0152mm 内层铜厚 / Dielectric3 0.2104mm 7628 RC49% 8.6mil / Bottom Layer 0.035mm 外层铜厚1oz

## Design rules (mm)
template: JLCPCB Capability(Two Layers Board)
spacing copperThickness1oz (default): track to track 0.102, other pairs 0.152 to 0.3
spacing copperThickness2oz: track to track 0.203, other pairs 0.152 to 0.3
track width copperThickness1oz (default): min 0.127, default 0.254, max 2.54
track width copperThickness2oz: min 0.203, default 0.254, max 2.54
differential pair differentialPair (default): width min 0.127, default 0.254, max 2.54; gap min 0.152, default 0.152
via viaSize (default): diameter min 0.5, default 0.61, max 10; hole min 0.3, default 0.305, max 6.3

## Placement (name value [footprint] x y rotation side)
1  XL-3528RGBW-WS2812B  [LED-SMD_4P-L3.5-W2.8-BR-1]  3 45 0 top
2  XL-3528RGBW-WS2812B  [LED-SMD_4P-L3.5-W2.8-BR-1]  9 45 0 top
3  XL-3528RGBW-WS2812B  [LED-SMD_4P-L3.5-W2.8-BR-1]  15 45 0 top
4  XL-3528RGBW-WS2812B  [LED-SMD_4P-L3.5-W2.8-BR-1]  21 45 0 top
5  XL-3528RGBW-WS2812B  [LED-SMD_4P-L3.5-W2.8-BR-1]  27 45 0 top
6  XL-3528RGBW-WS2812B  [LED-SMD_4P-L3.5-W2.8-BR-1]  33 45 0 top
7  XL-3528RGBW-WS2812B  [LED-SMD_4P-L3.5-W2.8-BR-1]  39 45 0 top
8  XL-3528RGBW-WS2812B  [LED-SMD_4P-L3.5-W2.8-BR-1]  45 45 0 top
9  XL-3528RGBW-WS2812B  [LED-SMD_4P-L3.5-W2.8-BR-1]  3 39 0 top
10  XL-3528RGBW-WS2812B  [LED-SMD_4P-L3.5-W2.8-BR-1]  9 39 0 top
11  XL-3528RGBW-WS2812B  [LED-SMD_4P-L3.5-W2.8-BR-1]  15 39 0 top
12  XL-3528RGBW-WS2812B  [LED-SMD_4P-L3.5-W2.8-BR-1]  21 39 0 top
13  XL-3528RGBW-WS2812B  [LED-SMD_4P-L3.5-W2.8-BR-1]  27 39 0 top
14  XL-3528RGBW-WS2812B  [LED-SMD_4P-L3.5-W2.8-BR-1]  33 39 0 top
15  XL-3528RGBW-WS2812B  [LED-SMD_4P-L3.5-W2.8-BR-1]  39 39 0 top
16  XL-3528RGBW-WS2812B  [LED-SMD_4P-L3.5-W2.8-BR-1]  45 39 0 top
17  XL-3528RGBW-WS2812B  [LED-SMD_4P-L3.5-W2.8-BR-1]  3 33 0 top
18  XL-3528RGBW-WS2812B  [LED-SMD_4P-L3.5-W2.8-BR-1]  9 33 0 top
19  XL-3528RGBW-WS2812B  [LED-SMD_4P-L3.5-W2.8-BR-1]  15 33 0 top
20  XL-3528RGBW-WS2812B  [LED-SMD_4P-L3.5-W2.8-BR-1]  21 33 0 top
21  XL-3528RGBW-WS2812B  [LED-SMD_4P-L3.5-W2.8-BR-1]  27 33 0 top
22  XL-3528RGBW-WS2812B  [LED-SMD_4P-L3.5-W2.8-BR-1]  33 33 0 top
23  XL-3528RGBW-WS2812B  [LED-SMD_4P-L3.5-W2.8-BR-1]  39 33 0 top
24  XL-3528RGBW-WS2812B  [LED-SMD_4P-L3.5-W2.8-BR-1]  45 33 0 top
25  XL-3528RGBW-WS2812B  [LED-SMD_4P-L3.5-W2.8-BR-1]  3 27 0 top
26  XL-3528RGBW-WS2812B  [LED-SMD_4P-L3.5-W2.8-BR-1]  9 27 0 top
27  XL-3528RGBW-WS2812B  [LED-SMD_4P-L3.5-W2.8-BR-1]  15 27 0 top
28  XL-3528RGBW-WS2812B  [LED-SMD_4P-L3.5-W2.8-BR-1]  21 27 0 top
29  XL-3528RGBW-WS2812B  [LED-SMD_4P-L3.5-W2.8-BR-1]  27 27 0 top
30  XL-3528RGBW-WS2812B  [LED-SMD_4P-L3.5-W2.8-BR-1]  33 27 0 top
31  XL-3528RGBW-WS2812B  [LED-SMD_4P-L3.5-W2.8-BR-1]  39 27 0 top
32  XL-3528RGBW-WS2812B  [LED-SMD_4P-L3.5-W2.8-BR-1]  45 27 0 top
33  XL-3528RGBW-WS2812B  [LED-SMD_4P-L3.5-W2.8-BR-1]  3 21 0 top
34  XL-3528RGBW-WS2812B  [LED-SMD_4P-L3.5-W2.8-BR-1]  9 21 0 top
35  XL-3528RGBW-WS2812B  [LED-SMD_4P-L3.5-W2.8-BR-1]  15 21 0 top
36  XL-3528RGBW-WS2812B  [LED-SMD_4P-L3.5-W2.8-BR-1]  21 21 0 top
37  XL-3528RGBW-WS2812B  [LED-SMD_4P-L3.5-W2.8-BR-1]  27 21 0 top
38  XL-3528RGBW-WS2812B  [LED-SMD_4P-L3.5-W2.8-BR-1]  33 21 0 top
39  XL-3528RGBW-WS2812B  [LED-SMD_4P-L3.5-W2.8-BR-1]  39 21 0 top
40  XL-3528RGBW-WS2812B  [LED-SMD_4P-L3.5-W2.8-BR-1]  45 21 0 top
41  XL-3528RGBW-WS2812B  [LED-SMD_4P-L3.5-W2.8-BR-1]  3 15 0 top
42  XL-3528RGBW-WS2812B  [LED-SMD_4P-L3.5-W2.8-BR-1]  9 15 0 top
43  XL-3528RGBW-WS2812B  [LED-SMD_4P-L3.5-W2.8-BR-1]  15 15 0 top
44  XL-3528RGBW-WS2812B  [LED-SMD_4P-L3.5-W2.8-BR-1]  21 15 0 top
45  XL-3528RGBW-WS2812B  [LED-SMD_4P-L3.5-W2.8-BR-1]  27 15 0 top
46  XL-3528RGBW-WS2812B  [LED-SMD_4P-L3.5-W2.8-BR-1]  33 15 0 top
47  XL-3528RGBW-WS2812B  [LED-SMD_4P-L3.5-W2.8-BR-1]  39 15 0 top
48  XL-3528RGBW-WS2812B  [LED-SMD_4P-L3.5-W2.8-BR-1]  45 15 0 top
49  XL-3528RGBW-WS2812B  [LED-SMD_4P-L3.5-W2.8-BR-1]  3 9 0 top
50  XL-3528RGBW-WS2812B  [LED-SMD_4P-L3.5-W2.8-BR-1]  9 9 0 top
51  XL-3528RGBW-WS2812B  [LED-SMD_4P-L3.5-W2.8-BR-1]  15 9 0 top
52  XL-3528RGBW-WS2812B  [LED-SMD_4P-L3.5-W2.8-BR-1]  21 9 0 top
53  XL-3528RGBW-WS2812B  [LED-SMD_4P-L3.5-W2.8-BR-1]  27 9 0 top
54  XL-3528RGBW-WS2812B  [LED-SMD_4P-L3.5-W2.8-BR-1]  33 9 0 top
55  XL-3528RGBW-WS2812B  [LED-SMD_4P-L3.5-W2.8-BR-1]  39 9 0 top
56  XL-3528RGBW-WS2812B  [LED-SMD_4P-L3.5-W2.8-BR-1]  45 9 0 top
57  XL-3528RGBW-WS2812B  [LED-SMD_4P-L3.5-W2.8-BR-1]  3 3 0 top
58  XL-3528RGBW-WS2812B  [LED-SMD_4P-L3.5-W2.8-BR-1]  9 3 0 top
59  XL-3528RGBW-WS2812B  [LED-SMD_4P-L3.5-W2.8-BR-1]  15 3 0 top
60  XL-3528RGBW-WS2812B  [LED-SMD_4P-L3.5-W2.8-BR-1]  21 3 0 top
61  XL-3528RGBW-WS2812B  [LED-SMD_4P-L3.5-W2.8-BR-1]  27 3 0 top
62  XL-3528RGBW-WS2812B  [LED-SMD_4P-L3.5-W2.8-BR-1]  33 3 0 top
63  XL-3528RGBW-WS2812B  [LED-SMD_4P-L3.5-W2.8-BR-1]  39 3 0 top
64  XL-3528RGBW-WS2812B  [LED-SMD_4P-L3.5-W2.8-BR-1]  45 3 0 top
C1  100nF  [C0805]  3.11 42.04 0 top
C2  100nF  [C0805]  9.11 42.04 0 top
C3  100nF  [C0805]  15.12 42.04 0 top
C4  100nF  [C0805]  27.06 42.04 0 top
C5  100nF  [C0805]  21.1 42.04 0 top
C6  100nF  [C0805]  33.14 42.04 0 top
C7  100nF  [C0805]  39.11 42.04 0 top
C8  100nF  [C0805]  45.02 42.04 0 top
C9  100nF  [C0805]  3.11 35.96 0 top
C10  100nF  [C0805]  9.11 35.93 0 top
C11  100nF  [C0805]  15.11 35.94 0 top
C12  100nF  [C0805]  21.11 35.86 0 top
C13  100nF  [C0805]  27.11 35.86 0 top
C14  100nF  [C0805]  33.11 35.86 0 top
C15  100nF  [C0805]  39.11 35.9 0 top
C16  100nF  [C0805]  45.02 35.92 0 top
C17  100nF  [C0805]  3.11 30.1 0 top
C18  100nF  [C0805]  9.11 30.13 0 top
C19  100nF  [C0805]  15.11 30.13 0 top
C20  100nF  [C0805]  21.11 30.15 0 top
C21  100nF  [C0805]  27.06 30.15 0 top
C22  100nF  [C0805]  33.11 30.13 0 top
C23  100nF  [C0805]  39.11 30.09 0 top
C24  100nF  [C0805]  45.02 30.08 0 top
C25  100nF  [C0805]  3.11 12 0 top
C26  100nF  [C0805]  9.11 23.97 0 top
C27  100nF  [C0805]  15.11 23.91 0 top
C28  100nF  [C0805]  21.11 23.91 0 top
C29  100nF  [C0805]  27.06 23.88 0 top
C30  100nF  [C0805]  33.11 23.88 0 top
C31  100nF  [C0805]  39.11 23.86 0 top
C32  100nF  [C0805]  45.02 6.05 0 top
C33  100nF  [C0805]  3.11 17.97 0 top
C34  100nF  [C0805]  9.11 17.97 0 top
C35  100nF  [C0805]  15.11 17.97 0 top
C36  100nF  [C0805]  21.11 17.97 0 top
C37  100nF  [C0805]  27.06 17.97 0 top
C38  100nF  [C0805]  33.11 17.97 0 top
C39  100nF  [C0805]  39.11 17.97 0 top
C40  100nF  [C0805]  45.02 17.97 0 top
C41  100nF  [C0805]  3.11 6.05 0 top
C42  100nF  [C0805]  9.11 12 0 top
C43  100nF  [C0805]  15.11 12 0 top
C44  100nF  [C0805]  21.11 12 0 top
C45  100nF  [C0805]  27.11 12 0 top
C46  100nF  [C0805]  33.11 12 0 top
C47  100nF  [C0805]  39.11 12 0 top
C48  100nF  [C0805]  45.02 12 0 top
C49  100nF  [C0805]  9.11 6.05 0 top
C50  100nF  [C0805]  15.11 6.05 0 top
C51  100nF  [C0805]  21.11 6.05 0 top
C52  100nF  [C0805]  27.11 6.05 0 top
C53  100nF  [C0805]  33.11 6.05 0 top
C54  100nF  [C0805]  39.11 6.05 0 top
GND  -  [长圆形单面焊盘]  1.8 20.8 0 bottom
GND#2  -  [长圆形单面焊盘]  46.12 21.06 180 bottom
IN  -  [长圆形单面焊盘]  1.8 26.88 0 bottom
OUT  -  [长圆形单面焊盘]  46.12 27.13 180 bottom
VCC  -  [长圆形单面焊盘]  1.8 23.83 0 bottom
VCC#2  -  [长圆形单面焊盘]  46.12 24.09 180 bottom

## Footprints (pads in the part's own frame, mm; a bottom-side part is the same pattern mirrored in y, then rotated)
C0805
  rect 1.41x1.35 smd: 1(-1,0) 2(1,0)
LED-SMD_4P-L3.5-W2.8-BR-1
  rect 1.199x0.899 smd: 1(1.501,-0.75) 2(1.501,0.75) 3(-1.501,0.75) 4(-1.501,-0.75)
长圆形单面焊盘
  oval 3x1.6 smd: 1(0,-0.127)

## Nets
As in the schematic, except:
GND: 1.3 2.3 3.3 4.3 5.3 6.3 7.3 8.3 9.3 10.3 11.3 12.3 13.3 14.3 15.3 16.3 17.3 18.3 19.3 20.3 21.3 22.3 23.3 24.3 25.3 26.3 27.3 28.3 29.3 30.3 31.3 32.3 33.3 34.3 35.3 36.3 37.3 38.3 39.3 40.3 41.3 42.3 43.3 44.3 45.3 46.3 47.3 48.3 49.3 50.3 51.3 52.3 53.3 54.3 55.3 56.3 57.3 58.3 59.3 60.3 61.3 62.3 63.3 64.3 C1.2 C2.2 C3.2 C4.2 C5.2 C6.2 C7.2 C8.2 C9.2 C10.2 C11.2 C12.2 C13.2 C14.2 C15.2 C16.2 C17.2 C18.2 C19.2 C20.2 C21.2 C22.2 C23.2 C24.2 C25.2 C26.2 C27.2 C28.2 C29.2 C30.2 C31.2 C32.2 C33.2 C34.2 C35.2 C36.2 C37.2 C38.2 C39.2 C40.2 C41.2 C42.2 C43.2 C44.2 C45.2 C46.2 C47.2 C48.2 C49.2 C50.2 C51.2 C52.2 C53.2 C54.2 GND.1 GND#2.1
VCC: 1.1 2.1 3.1 4.1 5.1 6.1 7.1 8.1 9.1 10.1 11.1 12.1 13.1 14.1 15.1 16.1 17.1 18.1 19.1 20.1 21.1 22.1 23.1 24.1 25.1 26.1 27.1 28.1 29.1 30.1 31.1 32.1 33.1 34.1 35.1 36.1 37.1 38.1 39.1 40.1 41.1 42.1 43.1 44.1 45.1 46.1 47.1 48.1 49.1 50.1 51.1 52.1 53.1 54.1 55.1 56.1 57.1 58.1 59.1 60.1 61.1 62.1 63.1 64.1 C1.1 C2.1 C3.1 C4.1 C5.1 C6.1 C7.1 C8.1 C9.1 C10.1 C11.1 C12.1 C13.1 C14.1 C15.1 C16.1 C17.1 C18.1 C19.1 C20.1 C21.1 C22.1 C23.1 C24.1 C25.1 C26.1 C27.1 C28.1 C29.1 C30.1 C31.1 C32.1 C33.1 C34.1 C35.1 C36.1 C37.1 C38.1 C39.1 C40.1 C41.1 C42.1 C43.1 C44.1 C45.1 C46.1 C47.1 C48.1 C49.1 C50.1 C51.1 C52.1 C53.1 C54.1 VCC.1 VCC#2.1

## Via types
v1: diameter 0.61, hole 0.305, Top Layer to Bottom Layer, 128 vias

## Routing (per net, layer and track width the routed paths; a pad name or vN(x,y) marks a point on that pad's centre or on a via; arc(x,y) is an arc through that point)
GND: length 10.8
  Top Layer w0.254: v1(4.9,42.9) 4.9,42.83 C1.2 ; v1(4.9,31) 4.9,30.89 C17.2 ; C25.2 4.91,12.8 5,12.8 ; C9.2 v1(4.95,36.8) 5,36.8 ; v1(5,6.9) 4.96,6.9 C41.2 ; v1(1.5,46.6) 1.3
  Bottom Layer w0.254: v1(47.3,22.7) 47.3,22.11 GND#2.1 ; v1(2.8,19.8) 2.8,19.93 GND.1
  vias: v1(4.92,12.9)
VCC: length 138.7
  Top Layer w0.254: C35.1 14.04,17.9 v1(13,17.9) ; v1(21.5,2.2) 22.45,2.2 60.1 ; v1(43,35.9) 44,35.9 C16.1 ; C41.1 3.5,7.44 v1(3.5,8.2) 4.45,8.2 49.1 ; C23.1 38.02,30 v1(37,30) ; 36.1 22.45,20.2 v1(21.5,20.2) ; C7.1 38.07,42 v1(37,42) ; v1(13,35.9) 14.08,35.9 C11.1 ; v1(15.5,32.2) 16.45,32.2 19.1 ; 57.1 4.45,2.2 v1(3.5,2.2) ; C39.1 38.04,17.9 v1(37,17.9) ; v1(15.5,8.2) 16.45,8.2 51.1 ; v1(27.5,38.2) 28.45,38.2 13.1 ; v1(31,42) 32.09,42 C6.1 ; 55.1 40.45,8.2 v1(39.5,8.2) ; v1(21.5,14.2) 22.45,14.2 44.1 ; v1(7,35.9) 8.08,35.9 C10.1 ; 62.1 34.45,2.2 v1(33.5,2.2) ; v1(42.86,17.97) C40.1 ; v1(31,35.9) 32.07,35.9 C14.1 ; v1(39.5,2.2) 40.45,2.2 63.1 ; 43.1 16.45,14.2 v1(15.5,14.2) ; v1(24.95,6.05) C52.1 ; v1(45.5,2.2) 46.45,2.2 64.1 ; v1(21.5,8.2) 22.45,8.2 52.1 ; C19.1 14.08,30.1 v1(13,30.1) ; C49.1 8.06,6 v1(7,6) ; 29.1 28.45,26.2 v1(27.5,26.2) ; 5.1 28.45,44.2 v1(27.5,44.2) ; v1(9.5,32.2) 10.45,32.2 18.1 ; C21.1 26.01,30.1 v1(24.9,30.1) ; 48.1 46.45,14.2 v1(45.5,14.2) ; v1(46.5,25.5) 32.1 ; 26.1 10.45,26.2 v1(9.5,26.2) ; v1(9.6,14.2) 10.45,14.2 42.1 ; v1(19,30.1) 20.06,30.1 C20.1 ; 21.1 28.45,32.2 v1(27.5,32.2) ; v1(3.5,26.2) 4.45,26.2 25.1 ; v1(27.5,20.2) 28.45,20.2 37.1 ; v1(33.5,38.2) 34.45,38.2 14.1 ; v1(6.95,23.97) C26.1 ; v1(9.5,8.2) 10.45,8.2 50.1 ; v1(45.5,38.2) 46.45,38.2 16.1 ; C31.1 38.05,23.8 v1(37,23.8) ; C30.1 32.03,23.8 v1(31,23.8) ; v1(15.5,44.2) 16.45,44.2 3.1 ; v1(31,30.1) 32.08,30.1 C22.1 ; v1(45.5,32.2) 46.45,32.2 24.1 ; 34.1 10.45,20.2 v1(9.5,20.2) ; 61.1 28.45,2.2 v1(27.5,2.2) ; v1(21.5,32.2) 22.45,32.2 20.1 ; v1(24.93,12) C45.1 ; 58.1 10.45,2.2 v1(9.5,2.2) ; C3.1 v1(12.96,42.04) 12.9,42.1 ; v1(12.94,23.91) C27.1 ; v1(9.5,44.2) 10.45,44.2 2.1 ; v1(39.5,38.2) 40.45,38.2 15.1 ; v1(45.6,19.6) 45.85,19.6 40.1 ; v1(15.5,20.2) 16.45,20.2 35.1 ; 47.1 40.45,14.2 v1(39.6,14.2) ; C2.1 7.97,41.9 v1(7.1,41.9) ; v1(42.81,6.05) C32.1 ; C17.1 3.5,31.49 v1(3.5,32.2) 4.45,32.2 17.1 ; 30.1 34.45,26.2 v1(33.5,26.2) ; 56.1 46.45,8.2 v1(45.5,8.2) ; 23.1 40.49,32.24 39.56,32.24 v1(39.5,32.3) ; v1(33.5,20.2) 34.45,20.2 38.1 ; v1(19,42) 20.05,42 C5.1 ; v1(19,35.8) 20.06,35.8 C12.1 ; 12.1 22.45,38.2 v1(21.5,38.2) ; 31.1 39.55,26.25 v1(39.5,26.2) ; 22.1 34.45,32.2 v1(33.5,32.2) ; 6.1 34.45,44.2 v1(33.5,44.2) ; v1(0.94,17.97) C33.1 ; 39.1 40.45,20.2 v1(39.5,20.2) ; v1(33.5,8.2) 34.45,8.2 54.1 ; v1(24.9,23.8) 25.97,23.8 C29.1 ; v1(12.9,12) C43.1 ; 53.1 28.45,8.2 v1(27.5,8.2) ; v1(21.5,44.2) 22.45,44.2 4.1 ; 11.1 16.45,38.2 v1(15.5,38.2) ; v1(37.1,35.9) C15.1 ; v1(31,11.9) 32.01,11.9 C46.1 ; v1(21.5,26.2) 22.45,26.2 28.1 ; C38.1 32.04,17.9 v1(31,17.9) ; C34.1 8.04,17.9 v1(7,17.9) ; v1(42.9,30) 43.94,30 C24.1 ; v1(24.93,35.86) C13.1 ; v1(9.5,38.2) 10.45,38.2 10.1 ; v1(42.9,42) 43.97,42 C8.1 ; 8.1 46.45,44.2 v1(45.5,44.2) ; v1(36.92,6.05) C54.1 ; 33.1 4.55,20.2 v1(5.5,20.2) ; v1(6.91,12) C42.1 ; v1(42.9,11.9) 43.92,11.9 C48.1 ; v1(19,23.8) 20,23.8 C28.1 ; C51.1 20.06,6 v1(19,6) ; v1(15.5,26.2) 16.45,26.2 27.1 ; C25.1 3.5,13.39 v1(3.5,14.2) 4.45,14.2 41.1 ; v1(33.5,14.2) 34.45,14.2 46.1 ; v1(18.98,12) C44.1 ; v1(15.5,2.2) 16.45,2.2 59.1 ; v1(12.96,6.05) C50.1 ; v1(27.4,14.2) 28.45,14.2 45.1 ; v1(37,12) C47.1 ; v1(6.98,30.13) C18.1 ; C1.1 3.5,43.43 v1(3.5,44.2) 4.45,44.2 1.1 ; v1(39.5,44.2) 40.45,44.2 7.1 ; C36.1 20.08,18 v1(19,18) ; C4.1 v1(25,42.04) ; 9.1 4.35,38.1 v1(3.5,38.1) 3.5,37.34 C9.1 ; v1(24.88,17.97) C37.1 ; v1(31,6.05) C53.1
  Bottom Layer w1: 3.3,25.01 v1(2.99,24.71) 2.25,23.96 VCC.1 ; VCC#2.1 46.12,23.39 45.21,22.47
  vias: v1(3.3,25.23) v1(45.1,22.4) v1(45.6,22.8)
IN: length 18.4
  Top Layer w0.254: v1(0.7,43.4) 0.7,43.45 1.4
  Bottom Layer w0.254: v1(0.7,43.4) 0.7,27.4 1.1,27 IN.1
LINE1: length 50.6
  Top Layer w0.254: 8.2 45,45.75 44.75,45.5 44.75,43.85 44.2,43.3 6.2,43.3 5.9,43 5.9,41.2 5.4,40.7 3.2,40.7 2.9,40.4 2.9,39.65 9.4
LINE2: length 50.6
  Top Layer w0.254: 46.44,39.73 44.93,39.73 44.68,39.47 44.68,37.83 44.13,37.28 6.13,37.28 5.83,36.98 5.83,35.18 5.33,34.68 3.13,34.68 2.83,34.38 2.83,33.63 1.43,32.23
LINE3: length 50.6
  Top Layer w0.254: 46.39,33.66 44.89,33.66 44.64,33.4 44.64,31.76 44.09,31.21 6.09,31.21 5.79,30.91 5.79,29.11 5.29,28.61 3.09,28.61 2.79,28.31 2.79,27.56 1.39,26.16
LINE4: length 50.6
  Top Layer w0.254: 1.42,20.16 2.82,21.56 2.82,22.31 3.12,22.61 5.32,22.61 5.82,23.11 5.82,24.91 6.12,25.21 44.12,25.21 44.66,25.76 44.66,27.41 44.92,27.66 46.42,27.66
LINE5: length 50.6
  Top Layer w0.254: 1.47,14.22 2.88,15.62 2.88,16.37 3.17,16.67 5.38,16.67 5.88,17.17 5.88,18.97 6.17,19.27 44.18,19.27 44.72,19.82 44.72,21.47 44.97,21.72 46.48,21.72
LINE6: length 50.7
  Top Layer w0.254: 46.42,15.75 44.92,15.75 44.66,15.5 44.66,13.85 44.12,13.3 6.12,13.3 5.82,13 5.82,11.2 5.32,10.7 3.12,10.7 2.82,10.4 2.82,9.42 1.65,8.25 1.42,8.25
LINE7: length 50.7
  Top Layer w0.254: 46.44,9.8 44.94,9.8 44.69,9.55 44.69,7.9 44.14,7.35 6.14,7.35 5.84,7.05 5.84,5.25 5.34,4.75 3.14,4.75 2.84,4.45 2.84,3.44 1.7,2.3 1.44,2.3
OUT: length 27.2
  Top Layer w0.254: v1(47.3,4.5) 46.55,3.75 64.2
  Bottom Layer w0.254: OUT.1 44.34,25.22 44.34,19.25 44.6,19 47.1,19 47.5,18.6 47.5,4.7 v1(47.3,4.5)
$1N1182: length 3.6
  Top Layer w0.254: 1.2 6,45.75 2.4
$1N1185: length 3.6
  Top Layer w0.254: 3.4 12,45.75 2.2
$1N1190: length 3.6
  Top Layer w0.254: 4.2 24,45.75 5.4
$1N1193: length 3.6
  Top Layer w0.254: 6.4 30,45.75 5.2
$1N1194: length 3.6
  Top Layer w0.254: 3.2 18,45.75 4.4
$1N1199: length 3.6
  Top Layer w0.254: 8.4 42,45.75 7.2
$1N1203: length 3.6
  Top Layer w0.254: 6.2 36,45.75 7.4
$1N7369: length 3.6
  Top Layer w0.254: 10.4 6,39.75 9.2
$1N7372: length 3.6
  Top Layer w0.254: 10.2 12,39.75 11.4
$1N7377: length 3.6
  Top Layer w0.254: 13.4 24,39.75 12.2
$1N7380: length 3.6
  Top Layer w0.254: 13.2 30,39.75 14.4
$1N7381: length 3.6
  Top Layer w0.254: 11.2 18,39.75 12.4
$1N7386: length 3.6
  Top Layer w0.254: 15.2 42,39.75 16.4
$1N7387: length 3.6
  Top Layer w0.254: 15.4 36,39.75 14.2
$1N7912: length 3.6
  Top Layer w0.254: 18.4 6,33.75 17.2
$1N7915: length 3.6
  Top Layer w0.254: 19.4 12,33.75 18.2
$1N7920: length 3.6
  Top Layer w0.254: 21.4 24,33.75 20.2
$1N7923: length 3.6
  Top Layer w0.254: 21.2 30,33.75 22.4
$1N7924: length 3.6
  Top Layer w0.254: 19.2 18,33.75 20.4
$1N7929: length 3.6
  Top Layer w0.254: 23.2 42,33.75 24.4
$1N7930: length 3.6
  Top Layer w0.254: 23.4 36,33.75 22.2
$1N8455: length 3.6
  Top Layer w0.254: 25.2 6,27.75 26.4
$1N8458: length 3.6
  Top Layer w0.254: 26.2 12,27.75 27.4
$1N8463: length 3.6
  Top Layer w0.254: 28.2 24,27.75 29.4
$1N8466: length 3.6
  Top Layer w0.254: 30.4 30,27.75 29.2
$1N8467: length 3.6
  Top Layer w0.254: 28.4 18,27.75 27.2
$1N8472: length 3.6
  Top Layer w0.254: 31.2 42,27.75 32.4
$1N8473: length 3.6
  Top Layer w0.254: 31.4 36,27.75 30.2
$1N8998: length 3.6
  Top Layer w0.254: 33.2 6,21.75 34.4
$1N9001: length 3.6
  Top Layer w0.254: 35.4 12,21.75 34.2
$1N9006: length 3.6
  Top Layer w0.254: 36.2 24,21.75 37.4
$1N9009: length 3.6
  Top Layer w0.254: 37.2 30,21.75 38.4
$1N9010: length 3.6
  Top Layer w0.254: 35.2 18,21.75 36.4
$1N9015: length 3.6
  Top Layer w0.254: 39.2 42,21.75 40.4
$1N9016: length 3.6
  Top Layer w0.254: 38.2 36,21.75 39.4
$1N9541: length 3.6
  Top Layer w0.254: 41.2 6,15.75 42.4
$1N9544: length 3.6
  Top Layer w0.254: 43.4 12,15.75 42.2
$1N9549: length 3.6
  Top Layer w0.254: 45.4 24,15.75 44.2
$1N9552: length 3.6
  Top Layer w0.254: 45.2 30,15.75 46.4
$1N9553: length 3.6
  Top Layer w0.254: 43.2 18,15.75 44.4
$1N9558: length 3.6
  Top Layer w0.254: 48.4 42,15.75 47.2
$1N9559: length 3.6
  Top Layer w0.254: 46.2 36,15.75 47.4
$1N10084: length 3.6
  Top Layer w0.254: 50.4 6,9.75 49.2
$1N10087: length 3.6
  Top Layer w0.254: 50.2 12,9.75 51.4
$1N10092: length 3.6
  Top Layer w0.254: 52.2 24,9.75 53.4
$1N10095: length 3.6
  Top Layer w0.254: 54.4 30,9.75 53.2
$1N10096: length 3.6
  Top Layer w0.254: 52.4 18,9.75 51.2
$1N10101: length 3.6
  Top Layer w0.254: 55.2 42,9.75 56.4
$1N10102: length 3.6
  Top Layer w0.254: 54.2 36,9.75 55.4
$1N10627: length 3.6
  Top Layer w0.254: 57.2 6,3.75 58.4
$1N10630: length 3.6
  Top Layer w0.254: 58.2 12,3.75 59.4
$1N10635: length 3.6
  Top Layer w0.254: 61.4 24,3.75 60.2
$1N10638: length 3.6
  Top Layer w0.254: 61.2 30,3.75 62.4
$1N10639: length 3.6
  Top Layer w0.254: 60.4 18,3.75 59.2
$1N10644: length 3.6
  Top Layer w0.254: 63.2 42,3.75 64.4
$1N10645: length 3.6
  Top Layer w0.254: 63.4 36,3.75 62.2

## Copper pours and planes (outline as drawn; the poured copper is in the pictures)
GND on Top Layer: -1.8,51.1 52.3,51.1 52.3,-4.2 -1.8,-4.2
GND on Bottom Layer: -4.1,52.5 51.5,52.5 51.5,-5.4 -4.1,-5.4
GND on GND: 0.26,47.74 47.74,47.74 47.74,0.26 0.26,0.26
VCC on VCC: 0.26,47.74 47.74,47.74 47.74,0.26 0.26,0.26

Small or netless copper shapes (teardrops, artwork), in the pictures only: 379 on Top Layer, 9 on Bottom Layer
